# Altium project KitKTS.PrjPcb (part 1 of 3)
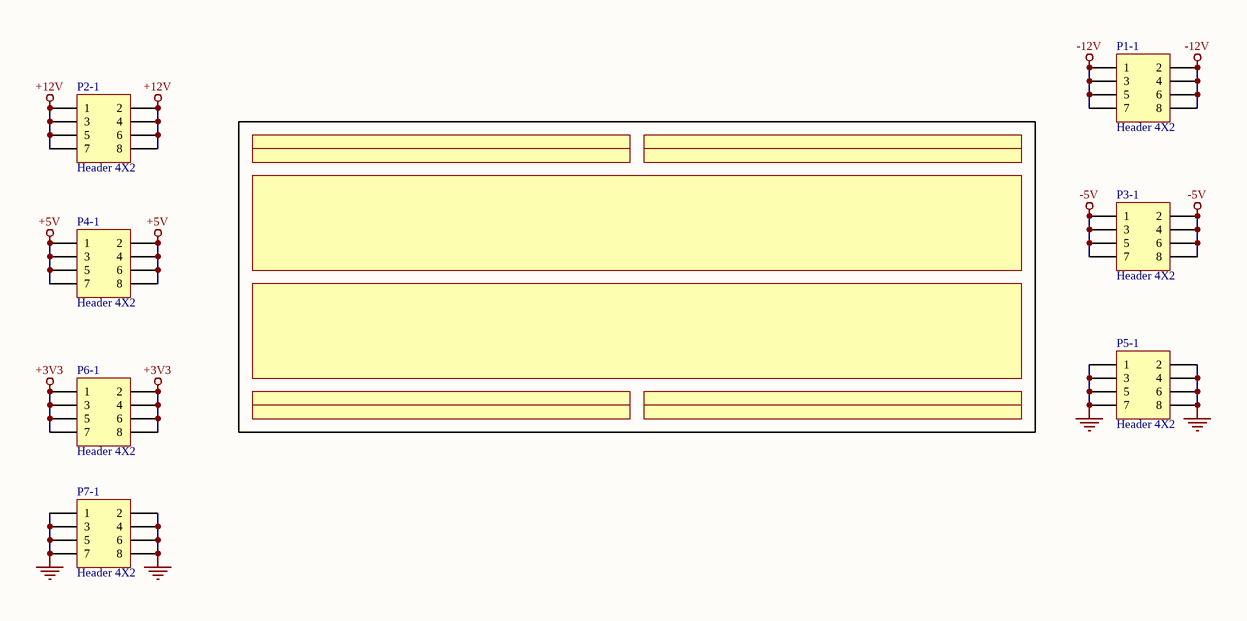
[diagram p0: 01-Breadboard.SchDoc]
26 sheets, 437 parts. Net scope: global (net labels, ports and power ports of the same name join across sheets).
Board file: KitKTS.PcbDoc
Sheets:
  01-Breadboard.SchDoc
  02-PowerSupply.SchDoc
  03-PulseGenerator.SchDoc
  04-LogicAND.SchDoc
  04-ANDStatusLed.SchDoc
  05-LogicOR.SchDoc
  05-ORStatusLed.SchDoc
  06-LogicNOT.SchDoc
  06-NOTStatusLed.SchDoc
  07-LogicXOR.SchDoc
  07-XORStatusLed.SchDoc
  08-LogicNAND.SchDoc
  08-NANDStatusLed.SchDoc
  09-LogicNOR.SchDoc
  09-NORStatusLed.SchDoc
  10-Buffer.SchDoc
  11-DFlipFlop.SchDoc
  12-JKFlipFlop.SchDoc
  13-Counter74LS90.SchDoc
  14-Counter74LS192.SchDoc
  15-DistanceSRF05.SchDoc
  16-BitSW.SchDoc
  16-BitSWStatusLed.SchDoc
  17-Led.SchDoc
  19-CPLD.SchDoc
  18-Led7.SchDoc

## Sheet 01-Breadboard.SchDoc
size A4; DocumentNumber: 4; SheetNumber: 1; SheetTotal: 26

### Parts
P1-1  Header 4X2  [JP2.54-F-2x04A]
P2-1  Header 4X2  [JP2.54-F-2x04A]
P3-1  Header 4X2  [JP2.54-F-2x04A]
P4-1  Header 4X2  [JP2.54-F-2x04A]
P5-1  Header 4X2  [JP2.54-F-2x04A]
P6-1  Header 4X2  [JP2.54-F-2x04A]
P7-1  Header 4X2  [JP2.54-F-2x04A]

### Nets
+3V3: P6-1.1 P6-1.2 P6-1.3 P6-1.4 P6-1.5 P6-1.6 P6-1.7 P6-1.8
+5V: P4-1.1 P4-1.2 P4-1.3 P4-1.4 P4-1.5 P4-1.6 P4-1.7 P4-1.8
+12V: P2-1.1 P2-1.2 P2-1.3 P2-1.4 P2-1.5 P2-1.6 P2-1.7 P2-1.8
-5V: P3-1.1 P3-1.2 P3-1.3 P3-1.4 P3-1.5 P3-1.6 P3-1.7 P3-1.8
-12V: P1-1.1 P1-1.2 P1-1.3 P1-1.4 P1-1.5 P1-1.6 P1-1.7 P1-1.8
GND: P5-1.1 P5-1.2 P5-1.3 P5-1.4 P5-1.5 P5-1.6 P5-1.7 P5-1.8 P7-1.1 P7-1.2 P7-1.3 P7-1.4 P7-1.5 P7-1.6 P7-1.7 P7-1.8

### Library data of the parts
P1-1 P2-1 P3-1 P4-1 P5-1 P6-1 P7-1 = Header 4X2: Header, 4-Pin, Dual row; LatestRevisionDate: 17-Jul-2002; LatestRevisionNote: Re-released for DXP Platform.; Publisher: Altium Limited

## Sheet 02-PowerSupply.SchDoc
size A4; DocumentNumber: 2; SheetNumber: 2; SheetTotal: 26
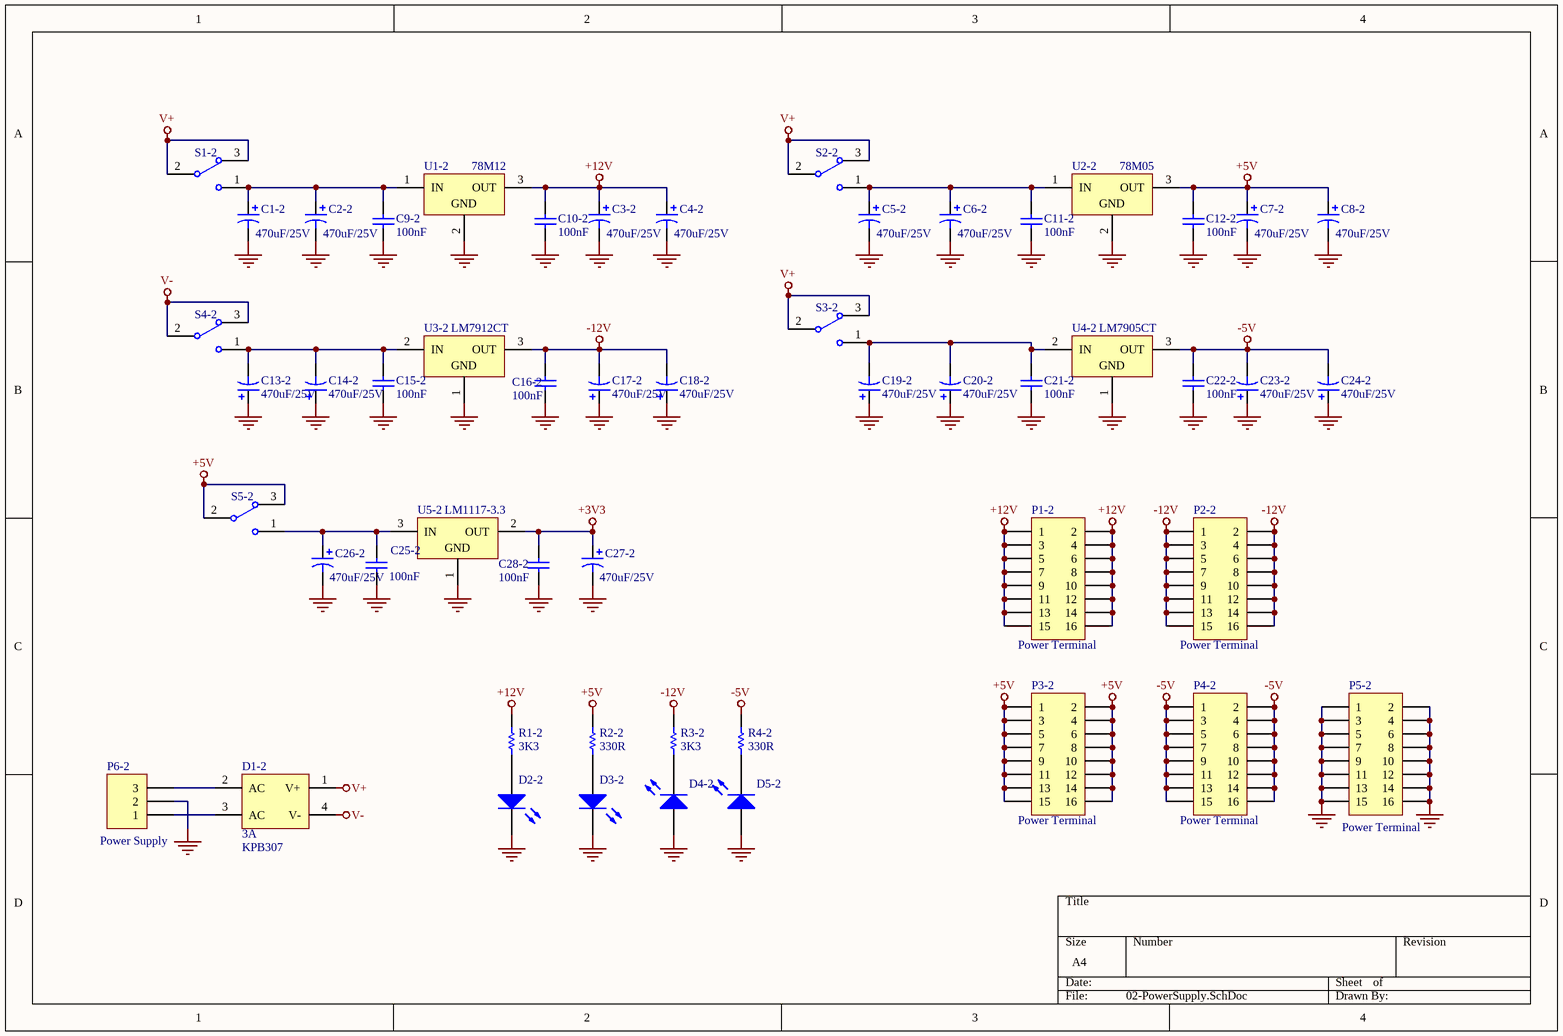
[diagram p1: 02-PowerSupply.SchDoc]

### Parts
C1-2  470uF/25V  [C-ALU-10x10mm]
C2-2  470uF/25V  [C-ALU-10x10mm]
C3-2  470uF/25V  [C-ALU-10x10mm]
C4-2  470uF/25V  [C-ALU-10x10mm]
C5-2  470uF/25V  [C-ALU-10x10mm]
C6-2  470uF/25V  [C-ALU-10x10mm]
C7-2  470uF/25V  [C-ALU-10x10mm]
C8-2  470uF/25V  [C-ALU-10x10mm]
C9-2  value 100nF  [c-0805]  (hidden comment: 104)
C10-2  value 100nF  [c-0805]  (hidden comment: 104)
C11-2  value 100nF  [c-0805]  (hidden comment: 104)
C12-2  value 100nF  [c-0805]  (hidden comment: 104)
C13-2  470uF/25V  [C-ALU-10x10mm]
C14-2  470uF/25V  [C-ALU-10x10mm]
C15-2  value 100nF  [c-0805]  (hidden comment: 104)
C16-2  value 100nF  [c-0805]  (hidden comment: 104)
C17-2  470uF/25V  [C-ALU-10x10mm]
C18-2  470uF/25V  [C-ALU-10x10mm]
C19-2  470uF/25V  [C-ALU-10x10mm]
C20-2  470uF/25V  [C-ALU-10x10mm]
C21-2  value 100nF  [c-0805]  (hidden comment: 104)
C22-2  value 100nF  [c-0805]  (hidden comment: 104)
C23-2  470uF/25V  [C-ALU-10x10mm]
C24-2  470uF/25V  [C-ALU-10x10mm]
C25-2  value 100nF  [c-0805]  (hidden comment: 104)
C26-2  470uF/25V  [C-ALU-10x10mm]
C27-2  470uF/25V  [C-ALU-10x10mm]
C28-2  value 100nF  [c-0805]  (hidden comment: 104)
D1-2  KPB307  value 3A  [D-DB-3A]
D2-2  LED  [LED-0805]  (value not drawn)
D3-2  LED  [LED-0805]  (value not drawn)
D4-2  LED  [LED-0805]  (value not drawn)
D5-2  LED  [LED-0805]  (value not drawn)
P1-2  value Power Terminal  [JP2.54-F-2x08A]  (hidden comment: Header 8X2)
P2-2  value Power Terminal  [JP2.54-F-2x08A]  (hidden comment: Header 8X2)
P3-2  value Power Terminal  [JP2.54-F-2x08A]  (hidden comment: Header 8X2)
P4-2  value Power Terminal  [JP2.54-F-2x08A]  (hidden comment: Header 8X2)
P5-2  value Power Terminal  [JP2.54-F-2x08A]  (hidden comment: Header 8X2)
P6-2  value Power Supply  [TER-KF128-3]  (hidden comment: H3)
R1-2  value 3K3  [R-0805]  (hidden comment: 332)
R2-2  value 330R  [R-0805]  (hidden comment: 331)
R3-2  value 3K3  [R-0805]  (hidden comment: 332)
R4-2  value 330R  [R-0805]  (hidden comment: 331)
S1-2  SW-SPDT  [SW-SLIDE-2P-2W]  (value not drawn)
S2-2  SW-SPDT  [SW-SLIDE-2P-2W]  (value not drawn)
S3-2  SW-SPDT  [SW-SLIDE-2P-2W]  (value not drawn)
S4-2  SW-SPDT  [SW-SLIDE-2P-2W]  (value not drawn)
S5-2  SW-SPDT  [SW-SLIDE-2P-2W]  (value not drawn)
U1-2  78M12  [TO-252-3]
U2-2  78M05  [TO-252-3]
U3-2  LM7912CT  [TO-263-3]
U4-2  LM7905CT  [TO-263-3]
U5-2  LM1117-3.3  [SOT-223-3]

### Nets
+3V3: C27-2.1 C28-2.2 U5-2.2(OUT)
+5V: C7-2.1 C8-2.1 C12-2.2 P3-2.1 P3-2.2 P3-2.3 P3-2.4 P3-2.5 P3-2.6 P3-2.7 P3-2.8 P3-2.9 P3-2.10 P3-2.11 P3-2.12 P3-2.13 P3-2.14 P3-2.15 P3-2.16 R2-2.1 S5-2.2 S5-2.3 U2-2.3(OUT)
+12V: C3-2.1 C4-2.1 C10-2.2 P1-2.1 P1-2.2 P1-2.3 P1-2.4 P1-2.5 P1-2.6 P1-2.7 P1-2.8 P1-2.9 P1-2.10 P1-2.11 P1-2.12 P1-2.13 P1-2.14 P1-2.15 P1-2.16 R1-2.1 U1-2.3(OUT)
-5V: C22-2.2 C23-2.2 C24-2.2 P4-2.1 P4-2.2 P4-2.3 P4-2.4 P4-2.5 P4-2.6 P4-2.7 P4-2.8 P4-2.9 P4-2.10 P4-2.11 P4-2.12 P4-2.13 P4-2.14 P4-2.15 P4-2.16 R4-2.1 U4-2.3(OUT)
-12V: C16-2.2 C17-2.2 C18-2.2 P2-2.1 P2-2.2 P2-2.3 P2-2.4 P2-2.5 P2-2.6 P2-2.7 P2-2.8 P2-2.9 P2-2.10 P2-2.11 P2-2.12 P2-2.13 P2-2.14 P2-2.15 P2-2.16 R3-2.1 U3-2.3(OUT)
GND: C1-2.2 C2-2.2 C3-2.2 C4-2.2 C5-2.2 C6-2.2 C7-2.2 C8-2.2 C9-2.1 C10-2.1 C11-2.1 C12-2.1 C13-2.1 C14-2.1 C15-2.1 C16-2.1 C17-2.1 C18-2.1 C19-2.1 C20-2.1 C21-2.1 C22-2.1 C23-2.1 C24-2.1 C25-2.1 C26-2.2 C27-2.2 C28-2.1 D2-2.1(K) D3-2.1(K) D4-2.2(A) D5-2.2(A) P5-2.1 P5-2.2 P5-2.3 P5-2.4 P5-2.5 P5-2.6 P5-2.7 P5-2.8 P5-2.9 P5-2.10 P5-2.11 P5-2.12 P5-2.13 P5-2.14 P5-2.15 P5-2.16 P6-2.2 U1-2.2(GND) U2-2.2(GND) U3-2.1(GND) U4-2.1(GND) U5-2.1(GND)
V+: D1-2.1(V+) S1-2.2 S1-2.3 S2-2.2 S2-2.3 S3-2.2 S3-2.3
V-: D1-2.4(V-) S4-2.2 S4-2.3
NetC1-2_1: C1-2.1 C2-2.1 C9-2.2 S1-2.1 U1-2.1(IN)
NetC5-2_1: C5-2.1 C6-2.1 C11-2.2 S2-2.1 U2-2.1(IN)
NetC13-2_2: C13-2.2 C14-2.2 C15-2.2 S4-2.1 U3-2.2(IN)
NetC19-2_2: C19-2.2 C20-2.2 C21-2.2 S3-2.1 U4-2.2(IN)
NetC25-2_2: C25-2.2 C26-2.1 S5-2.1 U5-2.3(IN)
NetD1-2_2: D1-2.2(AC) P6-2.3
NetD1-2_3: D1-2.3(AC) P6-2.1
NetD2-2_2: D2-2.2(A) R1-2.2
NetD3-2_2: D3-2.2(A) R2-2.2
NetD4-2_1: D4-2.1(K) R3-2.2
NetD5-2_1: D5-2.1(K) R4-2.2

### Library data of the parts
C1-2 C2-2 C3-2 C4-2 C5-2 C6-2 C7-2 C8-2 C13-2 C14-2 C17-2 C18-2 C19-2 C20-2 C23-2 C24-2 C26-2 C27-2 = Cap Pol1: Polarized Capacitor (Radial)
C9-2 C10-2 C11-2 C12-2 C15-2 C16-2 C21-2 C22-2 C25-2 C28-2 = Cap: Capacitor; Manufacturer: Generic Components; Class: Passive; Published: 08/06/2000; Publisher: Altium Hobart Technology Centre; SubClass: Capacitor
D1-2 = Bridge2: Diode Bridge; Published: 24-Mar-1999; LatestRevisionDate: 17-Jul-2002; LatestRevisionNote: Re-released for DXP Platform.; PackageReference: D-46_6A
D2-2 D3-2 D4-2 D5-2 = LED0: Typical INFRARED GaAs LED; Published: 8-Jun-2000; LatestRevisionDate: 08-Jul-2005; LatestRevisionNote: Mech Layer 1 removed.; PackageReference: LED-0; Publisher: Altium Limited; Value: LED
P1-2 P2-2 P3-2 P4-2 P5-2 = Header 8X2: Header, 8-Pin, Dual row; LatestRevisionDate: 17-Jul-2002; LatestRevisionNote: Re-released for DXP Platform.
P6-2 = Header 3: Header, 3-Pin; LatestRevisionDate: 17-Jul-2002; LatestRevisionNote: Re-released for DXP Platform.
R1-2 R2-2 R3-2 R4-2 = Res1: Resistor; Published: 8-Jun-2000; LatestRevisionDate: 17-Jul-2002; LatestRevisionNote: Re-released for DXP Platform.; PackageReference: AXIAL-0.3; Publisher: Altium Limited
S1-2 S2-2 S3-2 S4-2 S5-2 = SW-SPDT: SPDT Subminiature Toggle Switch, Right Angle Mounting, Vertical Actuation; Link: http://banlinhkien.vn/goods-5937-cong-tac-gat-6-chan-mss22d18-smd.html
U1-2 U2-2 = LM78M05CT: 3-Terminal Positive Voltage Regulators, 3-pin TO-220; Manufacturer: National Semiconductor; PackageTopMarking: NSUZXYTTE#*LM341T-5.0*LM78M05CT; PowerWise: N; CompType: LDO IC; Published: 4-Dec-2008; DatasheetVersion: Aug-2005; PackageVersion: revL, Jan-1992; PackageReference: T03B; Publisher: Altium Limited; PackageDescription: TO-220, Molded, 3 Lead, Straight; Supplier 1: Farnell; PartNumber: LM78M05CT; RoHS: N; PinCount: 3; ComponentLink1Description: LM78M05 Datasheet; ComponentLink1URL: http://www.national.com/ds/LM/LM78M05.pdf; ComponentLink2Description: LM78M05 Web Page; ComponentLink2URL: http://www.national.com/pf/LM/LM78M05.html; ComponentLink3Description: T03B Package Page; ComponentLink3URL: http://www.national.com/packaging/folders/t03b.html
  U1-2: Value: 78M12
  U2-2: Value: 78M05
U3-2 U4-2 = LM79M12CT: 3-Terminal Negative Regulators, 3-pin TO-220; Manufacturer: National Semiconductor; PackageTopMarking: NSUZXYTTE#*LM79M*12CT; PowerWise: N; CompType: LDO IC; Published: 4-Dec-2008; DatasheetVersion: Sep-2001; PackageVersion: revL, Jan-1992; PackageReference: T03B; Publisher: Altium Limited; PackageDescription: TO-220, Molded, 3 Lead, Straight; Supplier 1: Farnell; PartNumber: LM79M12CT; RoHS: N; PinCount: 3; ComponentLink1Description: LM79M12 Datasheet; ComponentLink1URL: http://www.national.com/ds/LM/LM79M12.pdf; ComponentLink2Description: LM79M12 Web Page; ComponentLink2URL: http://www.national.com/pf/LM/LM79M12.html; ComponentLink3Description: T03B Package Page; ComponentLink3URL: http://www.national.com/packaging/folders/t03b.html
  U3-2: Value: LM7912CT
  U4-2: Value: LM7905CT
U5-2 = LM1117IDTX-3.3: 800mA Low-Dropout Linear Regulator, 3-pin TO-252; Manufacturer: National Semiconductor; PackageTopMarking: NSUZXYTT*LM1117*IDT-3.3; PowerWise: N; CompType: LDO IC; Published: 1-Mar-2010; DatasheetVersion: Apr-2006; PackageVersion: revD, Feb-2009; PackageReference: TD03B; Publisher: Altium Limited; PackageDescription: TO252, Molded, Jedec, 6.8 x 6.10 x 2.30mm Body, 3 Lead, 2.28mm Pitch, Surface Mount; PartNumber: LM1117IDTX-3.3; Value: LM1117-3.3; PinCount: 3; Code_JEDEC: TO-252-AA; ComponentLink1Description: LM1117 Datasheet; ComponentLink1URL: http://www.national.com/ds/LM/LM1117.pdf; ComponentLink2Description: LM1117 Web Page; ComponentLink2URL: http://www.national.com/pf/LM/LM1117.html; ComponentLink3Description: TD03B Package Page; ComponentLink3URL: http://www.national.com/packaging/folders/td03b.html

## Sheet 03-PulseGenerator.SchDoc
size A4; DocumentNumber: 3; SheetNumber: 3; SheetTotal: 26
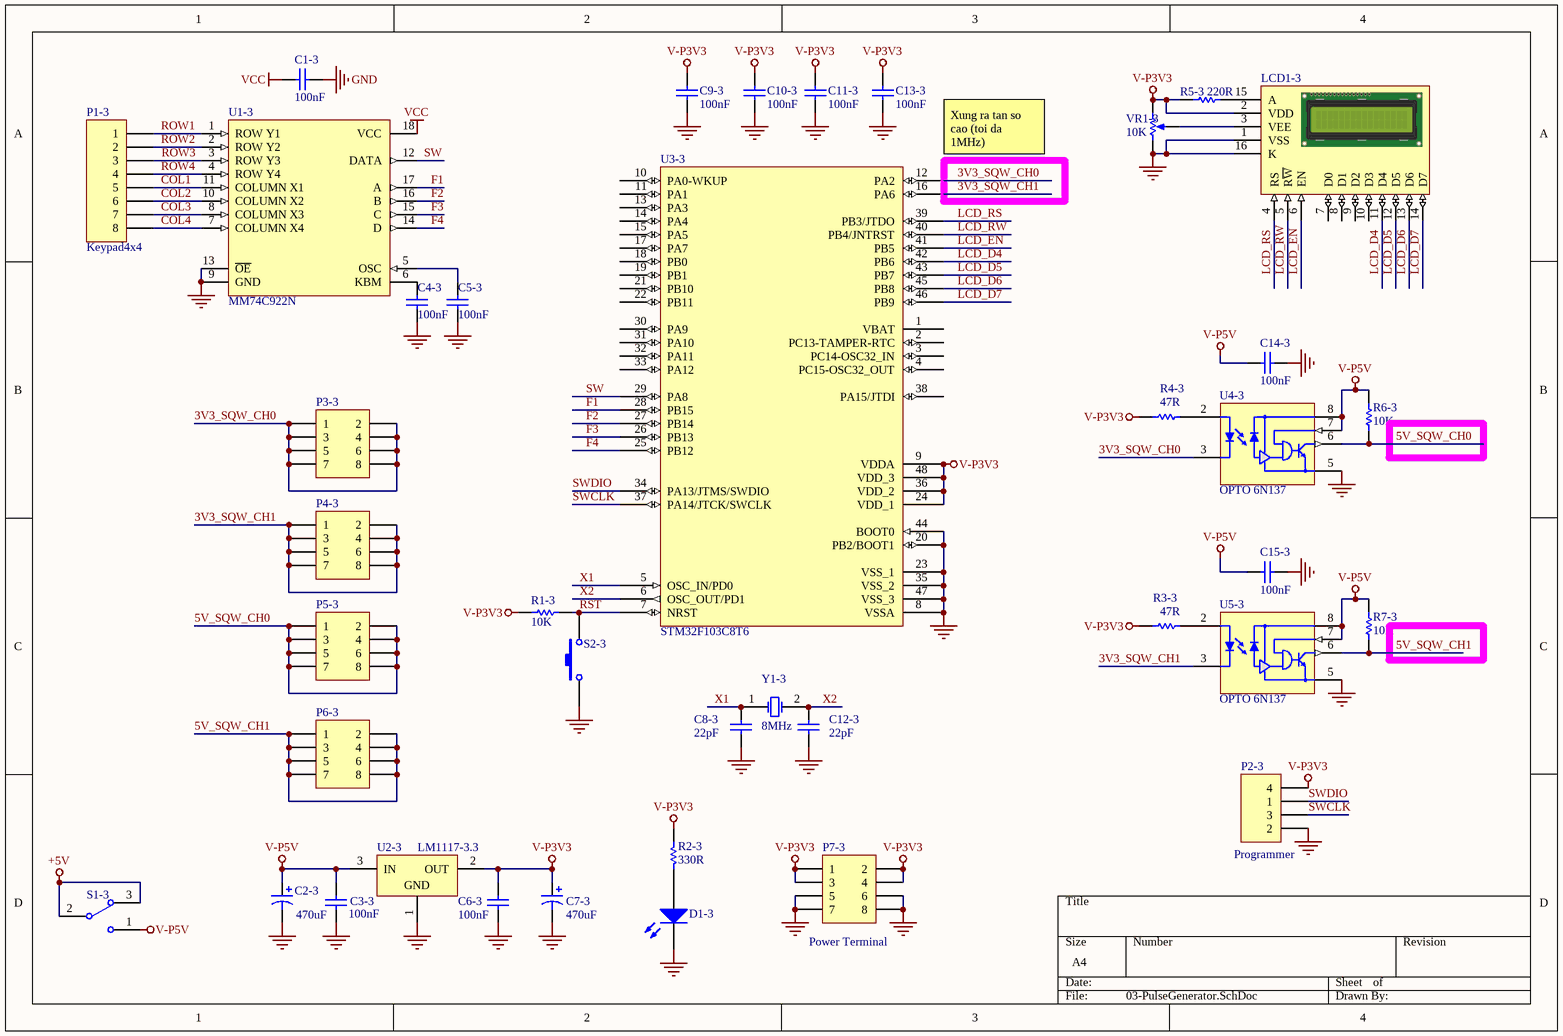
[diagram p2: 03-PulseGenerator.SchDoc]

### Parts
C1-3  value 100nF  [c-0805]  (hidden comment: 104)
C2-3  value 470uF  [C-ALU-10x10mm]  (hidden comment: 470uF/16V)
C3-3  value 100nF  [c-0805]  (hidden comment: 104)
C4-3  value 100nF  [c-0805]  (hidden comment: 104)
C5-3  value 100nF  [c-0805]  (hidden comment: 104)
C6-3  value 100nF  [c-0805]  (hidden comment: 104)
C7-3  value 470uF  [C-ALU-10x10mm]  (hidden comment: 470uF/16V)
C8-3  value 22pF  [c-0805]  (hidden comment: 22)
C9-3  value 100nF  [c-0805]  (hidden comment: 104)
C10-3  value 100nF  [c-0805]  (hidden comment: 104)
C11-3  value 100nF  [c-0805]  (hidden comment: 104)
C12-3  value 22pF  [c-0805]  (hidden comment: 22)
C13-3  value 100nF  [c-0805]  (hidden comment: 104)
C14-3  value 100nF  [c-0805]  (hidden comment: 104)
C15-3  value 100nF  [c-0805]  (hidden comment: 104)
D1-3  LED  [LED-0805]  (value not drawn)
LCD1-3  LCD1602  [LCD-1602A]  (value not drawn)
P1-3  Keypad4x4  [KEYPAD-4x4A]
P2-3  value Programmer  [JP2.54-M-1x04A]  (hidden comment: H4)
P3-3  Header 4X2  [JP2.54-F-2x04A]  (value not drawn)
P4-3  Header 4X2  [JP2.54-F-2x04A]  (value not drawn)
P5-3  Header 4X2  [JP2.54-F-2x04A]  (value not drawn)
P6-3  Header 4X2  [JP2.54-F-2x04A]  (value not drawn)
P7-3  Publisher: Power Terminal  [JP2.54-F-2x04A]  (hidden comment: Header 4X2)
R1-3  value 10K  [R-0805]  (hidden comment: Res1)
R2-3  value 330R  [R-0805]  (hidden comment: 331)
R3-3  47R  [R-0805]
R4-3  47R  [R-0805]
R5-3  220R  [R-0805]
R6-3  value 10K  [R-0805]  (hidden comment: Res1)
R7-3  value 10K  [R-0805]  (hidden comment: Res1)
S1-3  SW-SPDT  [SW-SLIDE-2P-2W]  (value not drawn)
S2-3  SW-S6  [SW-T-S6-SMD]  (value not drawn)
U1-3  MM74C922N  [SK-DIP18-300]
U2-3  LM1117-3.3  [SOT-223-3]
U3-3  STM32F103C8T6  [LQFP-48]
U4-3  OPTO 6N137  [DIP8-300-SMD]
U5-3  OPTO 6N137  [DIP8-300-SMD]
VR1-3  10K  [VR-3362P]
Y1-3  8MHz  [XTAL-CSM7]

### Nets
+5V: S1-3.2 S1-3.3
GND: C1-3.2 C2-3.2 C3-3.1 C4-3.2 C5-3.2 C6-3.1 C7-3.2 C8-3.1 C9-3.1 C10-3.1 C11-3.1 C12-3.1 C13-3.1 C14-3.1 C15-3.1 D1-3.2(K) LCD1-3.1(VSS) LCD1-3.16(K) P2-3.2 P7-3.5 P7-3.6 P7-3.7 P7-3.8 S2-3.1 U1-3.9(GND) U1-3.13(~{OE}) U2-3.1(GND) U3-3.8(VSSA) U3-3.20(PB2/BOOT1) U3-3.23(VSS_1) U3-3.35(VSS_2) U3-3.44(BOOT0) U3-3.47(VSS_3) U4-3.5(GND) U5-3.5(GND) VR1-3.1(TOP)
V-P3V3: C6-3.2 C7-3.1 C9-3.2 C10-3.2 C11-3.2 C13-3.2 LCD1-3.2(VDD) P2-3.4 P7-3.1 P7-3.2 P7-3.3 P7-3.4 R1-3.2 R2-3.1 R3-3.1 R4-3.1 R5-3.1 U2-3.2(OUT) U3-3.9(VDDA) U3-3.24(VDD_1) U3-3.36(VDD_2) U3-3.48(VDD_3) VR1-3.3(BOT)
V-P5V: C2-3.1 C3-3.2 C14-3.2 C15-3.2 R6-3.1 R7-3.1 S1-3.1 U2-3.3(IN) U4-3.7(EN) U4-3.8(VCC) U5-3.7(EN) U5-3.8(VCC)
VCC: C1-3.1 U1-3.18(VCC)
3V3_SQW_CH0: P3-3.1 P3-3.2 P3-3.3 P3-3.4 P3-3.5 P3-3.6 P3-3.7 P3-3.8 U3-3.12(PA2) U4-3.3(VF-)
3V3_SQW_CH1: P4-3.1 P4-3.2 P4-3.3 P4-3.4 P4-3.5 P4-3.6 P4-3.7 P4-3.8 U3-3.16(PA6) U5-3.3(VF-)
5V_SQW_CH0: P5-3.1 P5-3.2 P5-3.3 P5-3.4 P5-3.5 P5-3.6 P5-3.7 P5-3.8 R6-3.2 U4-3.6(Vo)
5V_SQW_CH1: P6-3.1 P6-3.2 P6-3.3 P6-3.4 P6-3.5 P6-3.6 P6-3.7 P6-3.8 R7-3.2 U5-3.6(Vo)
COL1: P1-3.5 U1-3.11(COLUMN_X1)
COL2: P1-3.6 U1-3.10(COLUMN_X2)
COL3: P1-3.7 U1-3.8(COLUMN_X3)
COL4: P1-3.8 U1-3.7(COLUMN_X4)
F1: U1-3.17(A) U3-3.28(PB15)
F2: U1-3.16(B) U3-3.27(PB14)
F3: U1-3.15(C) U3-3.26(PB13)
F4: U1-3.14(D) U3-3.25(PB12)
LCD_D4: LCD1-3.11(D4) U3-3.42(PB6)
LCD_D5: LCD1-3.12(D5) U3-3.43(PB7)
LCD_D6: LCD1-3.13(D6) U3-3.45(PB8)
LCD_D7: LCD1-3.14(D7) U3-3.46(PB9)
LCD_EN: LCD1-3.6(EN) U3-3.41(PB5)
LCD_RS: LCD1-3.4(RS) U3-3.39(PB3/JTDO)
LCD_RW: LCD1-3.5(R~{W}) U3-3.40(PB4/JNTRST)
ROW1: P1-3.1 U1-3.1(ROW_Y1)
ROW2: P1-3.2 U1-3.2(ROW_Y2)
ROW3: P1-3.3 U1-3.3(ROW_Y3)
ROW4: P1-3.4 U1-3.4(ROW_Y4)
RST: R1-3.1 S2-3.2 U3-3.7(NRST)
SW: U1-3.12(DATA) U3-3.29(PA8)
SWCLK: P2-3.3 U3-3.37(PA14/JTCK/SWCLK)
SWDIO: P2-3.1 U3-3.34(PA13/JTMS/SWDIO)
X1: C8-3.2 U3-3.5(OSC_IN/PD0) Y1-3.1(OSC1)
X2: C12-3.2 U3-3.6(OSC_OUT/PD1) Y1-3.2(OSC2)
NetC4-3_1: C4-3.1 U1-3.6(KBM)
NetC5-3_1: C5-3.1 U1-3.5(OSC)
NetD1-3_1: D1-3.1(A) R2-3.2
NetLCD1-3_3: LCD1-3.3(VEE) VR1-3.2(TAP)
NetLCD1-3_15: LCD1-3.15(A) R5-3.2
NetR3-3_2: R3-3.2 U5-3.2(VF+)
NetR4-3_2: R4-3.2 U4-3.2(VF+)

Not connected (* = marked no-connect by the designer): LCD1-3 7(D0) 8(D1) 9(D2) 10(D3); U3-3 1(VBAT) 2(PC13-TAMPER-RTC) 3(PC14-OSC32_IN) 4(PC15-OSC32_OUT) 10(PA0-WKUP) 11(PA1) 13(PA3) 14(PA4) 15(PA5) 17(PA7) 18(PB0) 19(PB1) 21(PB10) 22(PB11) 30(PA9) 31(PA10) 32(PA11) 33(PA12) 38(PA15/JTDI); U4-3 1(NC) 4(NC); U5-3 1(NC) 4(NC)

### Notes on the sheet
- Xung ra tan so cao (toi da 1MHz)

### Library data of the parts
C1-3 C4-3 C5-3 = Cap: CAP CER 0.1UF 50V Y5V 0805; Manufacturer: Yageo; Manufacturer Part Number: CC0805ZRY5V9BB104; Capacitance: 0.10µF; Tolerance: -20%, +80%; Temperature Coefficient: Y5V (F); Supplier 1: Digi-Key; Supplier Part Number 1: 311-1361-1-ND; RoHS: RoHS Compliant; Category: Capacitors; Stock 1: 348816; Pricing 1: 1=0.1, 10=0.033, 25=0.0232, 100=0.0151, 250=0.01232, 500=0.01056, 1000=0.00822 (USD); Packaging: Cut Tape (CT); Part Status: Active; Voltage - Rated: 50V; Mounting Type: Surface Mount, MLCC; Operating Temperature: -30°C ~ 85°C; Applications: General Purpose; Ratings: -; Package / Case: 0805 (2012 Metric); Size / Dimension: 0.079" L x 0.049" W (2.00mm x 1.25mm); Height - Seated (Max): -; Thickness (Max): 0.024" (0.60mm); Lead Spacing: -; Features: -; Lead Style: -; ComponentLink1URL: http://www.yageo.com/documents/recent/UPY-GPHC_Y5V_6.3V-to-50V_6.pdf; ComponentLink1Description: http://www.yageo.com/documents/recent/UPY-GPHC_Y5V_6.3V-to-50V_6.pdf
C2-3 C7-3 = Cap Pol1: Polarized Capacitor (Radial); Published: 8-Jun-2000; LatestRevisionDate: 17-Jul-2002; LatestRevisionNote: Re-released for DXP Platform.; PackageReference: RB7.6-15; Publisher: Altium Limited
C3-3 C6-3 C8-3 C12-3 = Cap: as C9-2 on sheet 02-PowerSupply; Published: 08/06/2000; Publisher: Altium Hobart Technology Centre; SubClass: Capacitor
C9-3 C10-3 C11-3 C13-3 C14-3 C15-3 = Cap: Capacitor; Published: 8-Jun-2000; LatestRevisionDate: 17-Jul-2002; LatestRevisionNote: Re-released for DXP Platform.; PackageReference: RAD-0.3; Publisher: Altium Limited; PackageDescription: Radial Cap, Thru-Hole; 2 Leads; 0.3 in Pin Spacing
D1-3 = LED0: Typical INFRARED GaAs LED; Published: 8-Jun-2000; LatestRevisionDate: 08-Jul-2005; LatestRevisionNote: Mech Layer 1 removed.; PackageReference: LED-0; Publisher: Altium Limited; Value: LED
LCD1-3 = LCD1602: Liquid Crystal Display; Value: LCD1602
P1-3 = Header 8: Header, 8-Pin; LatestRevisionDate: 17-Jul-2002; LatestRevisionNote: Re-released for DXP Platform.; Publisher: Altium Limited
P2-3 = Header 4: Header, 4-Pin; LatestRevisionDate: 17-Jul-2002; LatestRevisionNote: Re-released for DXP Platform.
P3-3 P4-3 P5-3 P6-3 P7-3 = Header 4X2: Header, 4-Pin, Dual row; LatestRevisionDate: 17-Jul-2002; LatestRevisionNote: Re-released for DXP Platform.
  P3-3 P4-3 P5-3 P6-3: Publisher: Power Terminal
R1-3 R2-3 R3-3 R4-3 R5-3 R6-3 R7-3 = Res1: Resistor; Published: 8-Jun-2000; LatestRevisionDate: 17-Jul-2002; LatestRevisionNote: Re-released for DXP Platform.; PackageReference: AXIAL-0.3; Publisher: Altium Limited
  R3-3 R4-3: Value: 47R
  R5-3: PackageDescription: Axial Device, Thru-Hole; 2 Leads; 0.3 in Pin Spacing; Value: 220R
S1-3 = SW-SPDT: as S1-2 on sheet 02-PowerSupply; Link: http://banlinhkien.vn/goods-5937-cong-tac-gat-6-chan-mss22d18-smd.html
S2-3 = SW-PB: Switch; Value: Reset; Published: 24-Mar-1999; LatestRevisionDate: 17-Jul-2002; LatestRevisionNote: Re-released for DXP Platform.; PackageReference: SPST-2; PackageDescription: Switch; 2 Leads
U2-3 = LM1117IDTX-3.3: as U5-2 on sheet 02-PowerSupply; Published: 1-Mar-2010; DatasheetVersion: Apr-2006; PackageVersion: revD, Feb-2009; PackageReference: TD03B; Publisher: Altium Limited; PackageDescription: TO252, Molded, Jedec, 6.8 x 6.10 x 2.30mm Body, 3 Lead, 2.28mm Pitch, Surface Mount; PartNumber: LM1117IDTX-3.3; Value: LM1117-3.3; PinCount: 3; Code_JEDEC: TO-252-AA; ComponentLink1Description: LM1117 Datasheet; ComponentLink1URL: http://www.national.com/ds/LM/LM1117.pdf; ComponentLink2Description: LM1117 Web Page; ComponentLink2URL: http://www.national.com/pf/LM/LM1117.html; ComponentLink3Description: TD03B Package Page; ComponentLink3URL: http://www.national.com/packaging/folders/td03b.html
U3-3 = STM32F103C8T6: STM32 ARM-based 32-bit MCU with 64 Kbytes Flash, 48-pin LQFP, Industrial Temperature; Published: 30-May-2008; DatasheetVersion: rev6, Mar-2008; PackageVersion: Mar-2008; PackageReference: LQFP48; Publisher: Altium Limited; PackageDescription: 48-Pin Low-Profile Quad Flat Pack, 7 x 7 mm Body, 0.5 mm Pitch (LQFP48); ComponentLink1Description: Manufacturer Link; ComponentLink1URL: www.st.com/stm32; ComponentLink2Description: Datasheet; ComponentLink2URL: http://www.st.com/stonline/products/literature/ds/13587.pdf
U4-3 U5-3 = OPTO 6N137: High Speed 10MBit/s Logic Gata Optocouplers; Value: 6N137
VR1-3 = RPot: Potentiometer; Sim Note: Enter the Resistance value and the set point into parameter fields.; Set Position: 0.5; Published: 8-Jun-2000; LatestRevisionDate: 17-Jul-2002; LatestRevisionNote: Re-released for DXP Platform.; PackageReference: VR5; Publisher: Altium Limited; PackageDescription: Variable Resistor, Thru-Hole; 3 Leads; Value: 10K
Y1-3 = XTAL: Crystal Oscillator; Published: 8-Jun-2000; LatestRevisionDate: 17-Jul-2002; LatestRevisionNote: Re-released for DXP Platform.; PackageReference: R38; Value: 8MHz; PackageDescription: Crystal, Thru-Hole; 2 Leads; Body 3.1 x 8.2 mm (Dia.xH)

## Sheet 04-LogicAND.SchDoc
size A4; DocumentNumber: 4; SheetNumber: 4; SheetTotal: 26
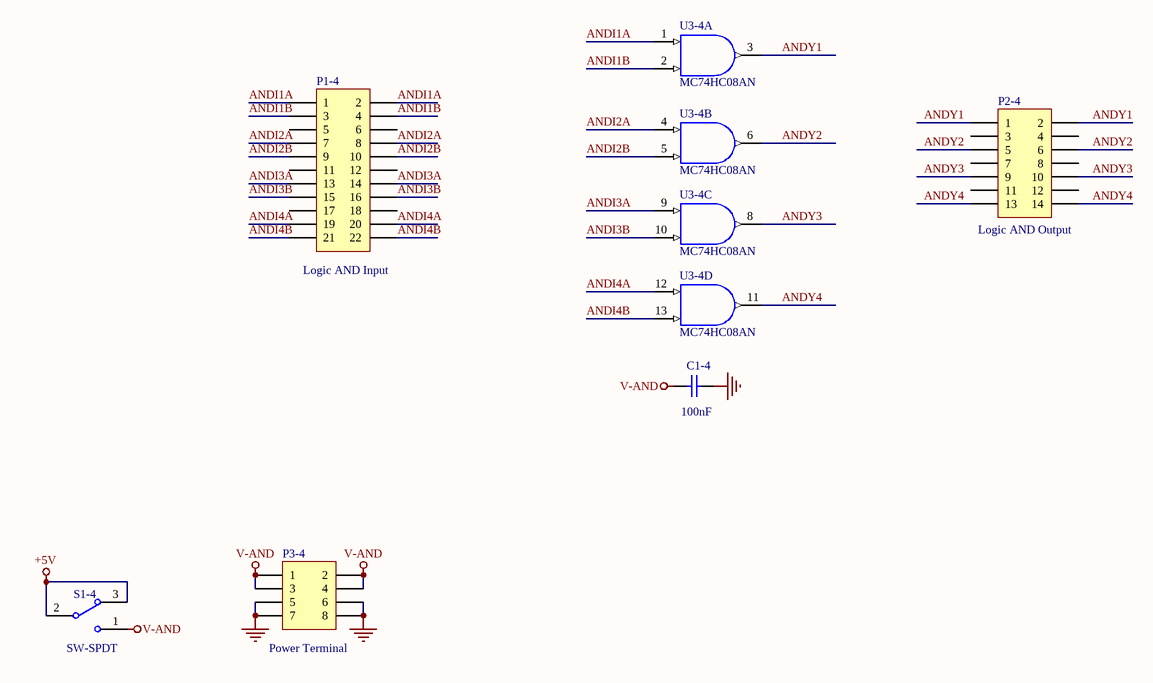
[diagram p3: 04-LogicAND.SchDoc]

### Parts
C1-4  value 100nF  [c-0805]  (hidden comment: 104)
P1-4  value Logic AND Input  [JP2.54-F-2x11A]  (hidden comment: Header 11X2)
P2-4  value Logic AND Output  [JP2.54-F-2x07A]  (hidden comment: H7X2)
P3-4  Publisher: Power Terminal  [JP2.54-F-2x04A]  (hidden comment: Header 4X2)
S1-4  SW-SPDT  [SW-SLIDE-2P-2W]
U3-4  MC74HC08AN  [SK-DIP14-300]  (parts A,B,C,D of 4)

### Nets
+5V: S1-4.2 S1-4.3
GND: C1-4.2 P3-4.5 P3-4.6 P3-4.7 P3-4.8 U3-4.7(GND)
V-AND: C1-4.1 P3-4.1 P3-4.2 P3-4.3 P3-4.4 S1-4.1
VDD: U3-4.14(V-AND)
ANDI1A: P1-4.1 P1-4.2 U3-4.1(A)
ANDI1B: P1-4.3 P1-4.4 U3-4.2(B)
ANDI2A: P1-4.7 P1-4.8 U3-4.4(A)
ANDI2B: P1-4.9 P1-4.10 U3-4.5(B)
ANDI3A: P1-4.13 P1-4.14 U3-4.9(A)
ANDI3B: P1-4.15 P1-4.16 U3-4.10(B)
ANDI4A: P1-4.19 P1-4.20 U3-4.12(A)
ANDI4B: P1-4.21 P1-4.22 U3-4.13(B)
ANDY1: P2-4.1 P2-4.2 U3-4.3(Y)
ANDY2: P2-4.5 P2-4.6 U3-4.6(Y)
ANDY3: P2-4.9 P2-4.10 U3-4.8(Y)
ANDY4: P2-4.13 P2-4.14 U3-4.11(Y)

Not connected (* = marked no-connect by the designer): P1-4 5 6 11 12 17 18; P2-4 3 4 7 8 11 12

### Library data of the parts
C1-4 = Cap: Capacitor; Published: 8-Jun-2000; LatestRevisionDate: 17-Jul-2002; LatestRevisionNote: Re-released for DXP Platform.; PackageReference: RAD-0.3; Publisher: Altium Limited; PackageDescription: Radial Cap, Thru-Hole; 2 Leads; 0.3 in Pin Spacing
P1-4 = Header 11X2: Header, 11-Pin, Dual row; LatestRevisionDate: 17-Jul-2002; LatestRevisionNote: Re-released for DXP Platform.
P2-4 = Header 7X2: Header, 7-Pin, Dual row; LatestRevisionDate: 17-Jul-2002; LatestRevisionNote: Re-released for DXP Platform.
P3-4 = Header 4X2: Header, 4-Pin, Dual row; LatestRevisionDate: 17-Jul-2002; LatestRevisionNote: Re-released for DXP Platform.
S1-4 = SW-SPDT: as S1-2 on sheet 02-PowerSupply; Published: 24-Mar-1999; LatestRevisionDate: 17-Dec-2003; LatestRevisionNote: Schematic revised, PCB Footprint replaced.; DatasheetVersion: 05-Dec-2000; PackageReference: TL36WW15050; Publisher: Altium Limited; PackageDescription: Switch; 4 Leads; ComponentLink1Description: Manufacturer Link; ComponentLink1URL: http://www.apem.com
U3-4 = MC74HC08AN: Quad 2-Input AND Gate; Published: 17-Jul-2002; LatestRevisionDate: 06-Jun-2005; LatestRevisionNote: Stylized 3D Model Added; DatasheetVersion: 1989; PackageVersion: 1997; PackageReference: 646-06; Publisher: Altium Limited; PackageDescription: DIP; 14 Leads; Row Spacing 7.62 mm; Pitch 2.54 mm; ComponentLink1Description: Manufacturer Link; ComponentLink1URL: http://www.onsemi.com/site/products/parametrics/0,4446,247,00.html; ComponentLink2Description: Ibis Model; ComponentLink2URL: http://www.onsemi.com/pub/Collateral/MC54HC08AJ.IBS

## Sheet 04-ANDStatusLed.SchDoc
size A4; DocumentNumber: 4; SheetNumber: 4; SheetTotal: 26
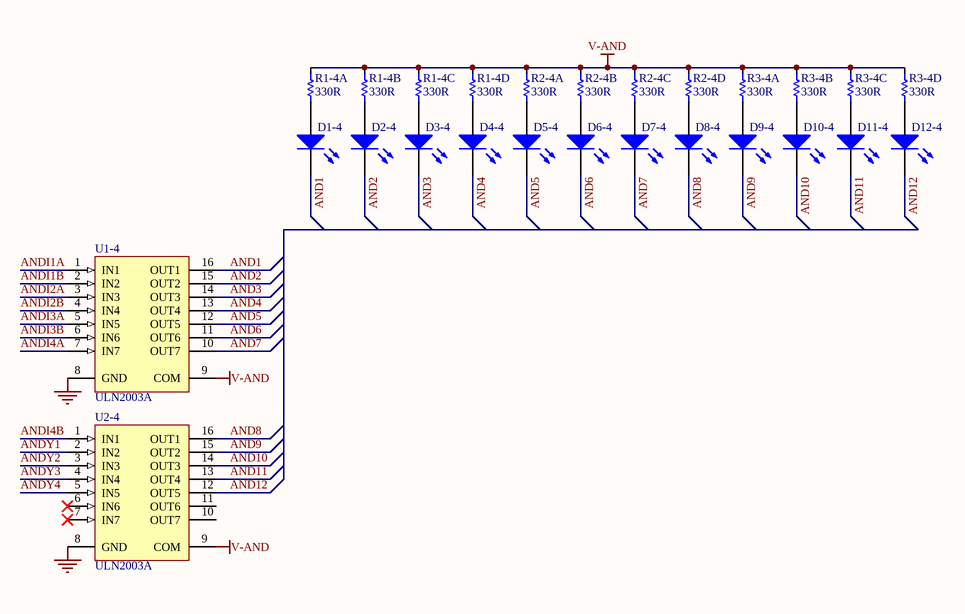
[diagram p4: 04-ANDStatusLed.SchDoc]

### Parts
D1-4  LED  [LED-0805]  (value not drawn)
D2-4  LED  [LED-0805]  (value not drawn)
D3-4  LED  [LED-0805]  (value not drawn)
D4-4  LED  [LED-0805]  (value not drawn)
D5-4  LED  [LED-0805]  (value not drawn)
D6-4  LED  [LED-0805]  (value not drawn)
D7-4  LED  [LED-0805]  (value not drawn)
D8-4  LED  [LED-0805]  (value not drawn)
D9-4  LED  [LED-0805]  (value not drawn)
D10-4  LED  [LED-0805]  (value not drawn)
D11-4  LED  [LED-0805]  (value not drawn)
D12-4  LED  [LED-0805]  (value not drawn)
R1-4  330R  [R-Array-0603-4]  (parts A,B,C,D of 4)
R2-4  330R  [R-Array-0603-4]  (parts A,B,C,D of 4)
R3-4  330R  [R-Array-0603-4]  (parts A,B,C,D of 4)
U1-4  ULN2003A  [SOIC-16]
U2-4  ULN2003A  [SOIC-16]

### Nets
GND: U1-4.8(GND) U2-4.8(GND)
V-AND: R1-4.2 R1-4.4 R1-4.6 R1-4.8 R2-4.2 R2-4.4 R2-4.6 R2-4.8 R3-4.2 R3-4.4 R3-4.6 R3-4.8 U1-4.9(COM) U2-4.9(COM)
AND1: D1-4.2(K) U1-4.16(OUT1)
AND2: D2-4.2(K) U1-4.15(OUT2)
AND3: D3-4.2(K) U1-4.14(OUT3)
AND4: D4-4.2(K) U1-4.13(OUT4)
AND5: D5-4.2(K) U1-4.12(OUT5)
AND6: D6-4.2(K) U1-4.11(OUT6)
AND7: D7-4.2(K) U1-4.10(OUT7)
AND8: D8-4.2(K) U2-4.16(OUT1)
AND9: D9-4.2(K) U2-4.15(OUT2)
AND10: D10-4.2(K) U2-4.14(OUT3)
AND11: D11-4.2(K) U2-4.13(OUT4)
AND12: D12-4.2(K) U2-4.12(OUT5)
ANDI1A: U1-4.1(IN1)
ANDI1B: U1-4.2(IN2)
ANDI2A: U1-4.3(IN3)
ANDI2B: U1-4.4(IN4)
ANDI3A: U1-4.5(IN5)
ANDI3B: U1-4.6(IN6)
ANDI4A: U1-4.7(IN7)
ANDI4B: U2-4.1(IN1)
ANDY1: U2-4.2(IN2)
ANDY2: U2-4.3(IN3)
ANDY3: U2-4.4(IN4)
ANDY4: U2-4.5(IN5)
NetD1-4_1: D1-4.1(A) R1-4.1
NetD2-4_1: D2-4.1(A) R1-4.3
NetD3-4_1: D3-4.1(A) R1-4.5
NetD4-4_1: D4-4.1(A) R1-4.7
NetD5-4_1: D5-4.1(A) R2-4.1
NetD6-4_1: D6-4.1(A) R2-4.3
NetD7-4_1: D7-4.1(A) R2-4.5
NetD8-4_1: D8-4.1(A) R2-4.7
NetD9-4_1: D9-4.1(A) R3-4.1
NetD10-4_1: D10-4.1(A) R3-4.3
NetD11-4_1: D11-4.1(A) R3-4.5
NetD12-4_1: D12-4.1(A) R3-4.7

Not connected (* = marked no-connect by the designer): U2-4 6(IN6)* 7(IN7)* 10(OUT7) 11(OUT6)

### Library data of the parts
D1-4 D2-4 D3-4 D4-4 D5-4 D6-4 D7-4 D8-4 D9-4 D10-4 D11-4 D12-4 = LED2: Typical RED, GREEN, YELLOW, AMBER GaAs LED; Published: 8-Jun-2000; LatestRevisionDate: 17-Jul-2002; LatestRevisionNote: Re-released for DXP Platform.; PackageVersion: Feb-2002; PackageReference: 3.2X1.6X1.1; Publisher: Altium Limited; PackageDescription: SM LED; 2 Flat Leads
R1-4 R2-4 R3-4 = Res Array 4: RES ARRAY 4 RES 330 OHM 1206; Manufacturer: Panasonic Electronic Components; Manufacturer Part Number: EXB-38V331JV; Digi-Key Part Number: Y9331TR-ND; Link: http://www.digikey.com/product-detail/en/EXB-38V331JV/Y9331TR-ND/256525
U1-4 U2-4 = ULN2003A: High-Voltage, High-Current Darlington Array; Published: 13-Oct-2000; LatestRevisionDate: 06-Jun-2005; LatestRevisionNote: Stylized 3D Model Added.; DatasheetVersion: 1998; PackageVersion: 1998; PackageReference: A16; Publisher: Altium Limited; PackageDescription: DIP; 16 Leads; Row Spacing 7.62 mm; Pitch 2.54 mm; Code_JEDEC: MS-001-BB; ComponentLink1Description: Manufacturer Link; ComponentLink1URL: http://www.allegromicro.com/

## Sheet 05-LogicOR.SchDoc
size A4; DocumentNumber: 5; SheetNumber: 5; SheetTotal: 26
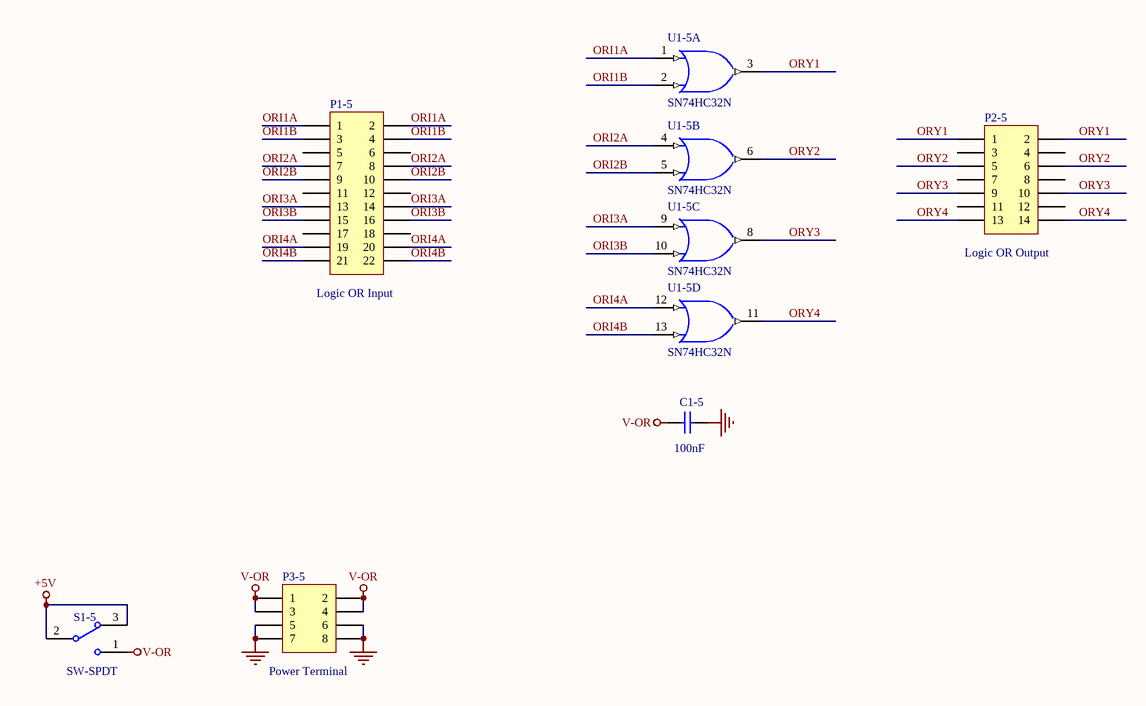
[diagram p5: 05-LogicOR.SchDoc]

### Parts
C1-5  value 100nF  [c-0805]  (hidden comment: 104)
P1-5  value Logic OR Input  [JP2.54-F-2x11A]  (hidden comment: Header 11X2)
P2-5  value Logic OR Output  [JP2.54-F-2x07A]  (hidden comment: H7X2)
P3-5  Publisher: Power Terminal  [JP2.54-F-2x04A]  (hidden comment: Header 4X2)
S1-5  SW-SPDT  [SW-SLIDE-2P-2W]
U1-5  SN74HC32N  [SK-DIP14-300]  (parts A,B,C,D of 4)

### Nets
+5V: S1-5.2 S1-5.3
GND: C1-5.2 P3-5.5 P3-5.6 P3-5.7 P3-5.8 U1-5.7(GND)
V-OR: C1-5.1 P3-5.1 P3-5.2 P3-5.3 P3-5.4 S1-5.1
VCC: U1-5.14(V-OR)
ORI1A: P1-5.1 P1-5.2 U1-5.1(A)
ORI1B: P1-5.3 P1-5.4 U1-5.2(B)
ORI2A: P1-5.7 P1-5.8 U1-5.4(A)
ORI2B: P1-5.9 P1-5.10 U1-5.5(B)
ORI3A: P1-5.13 P1-5.14 U1-5.9(A)
ORI3B: P1-5.15 P1-5.16 U1-5.10(B)
ORI4A: P1-5.19 P1-5.20 U1-5.12(A)
ORI4B: P1-5.21 P1-5.22 U1-5.13(B)
ORY1: P2-5.1 P2-5.2 U1-5.3(Y)
ORY2: P2-5.5 P2-5.6 U1-5.6(Y)
ORY3: P2-5.9 P2-5.10 U1-5.8(Y)
ORY4: P2-5.13 P2-5.14 U1-5.11(Y)

Not connected (* = marked no-connect by the designer): P1-5 5 6 11 12 17 18; P2-5 3 4 7 8 11 12

### Library data of the parts
C1-5 = Cap: Capacitor; Published: 8-Jun-2000; LatestRevisionDate: 17-Jul-2002; LatestRevisionNote: Re-released for DXP Platform.; PackageReference: RAD-0.3; Publisher: Altium Limited; PackageDescription: Radial Cap, Thru-Hole; 2 Leads; 0.3 in Pin Spacing
P1-5 = Header 11X2: Header, 11-Pin, Dual row; LatestRevisionDate: 17-Jul-2002; LatestRevisionNote: Re-released for DXP Platform.
P2-5 = Header 7X2: Header, 7-Pin, Dual row; LatestRevisionDate: 17-Jul-2002; LatestRevisionNote: Re-released for DXP Platform.
P3-5 = Header 4X2: Header, 4-Pin, Dual row; LatestRevisionDate: 17-Jul-2002; LatestRevisionNote: Re-released for DXP Platform.
S1-5 = SW-SPDT: as S1-2 on sheet 02-PowerSupply; Published: 24-Mar-1999; LatestRevisionDate: 17-Dec-2003; LatestRevisionNote: Schematic revised, PCB Footprint replaced.; DatasheetVersion: 05-Dec-2000; PackageReference: TL36WW15050; Publisher: Altium Limited; PackageDescription: Switch; 4 Leads; ComponentLink1Description: Manufacturer Link; ComponentLink1URL: http://www.apem.com
U1-5 = SN74HC32N: Quadruple 2-Input Positive-OR Gate; Published: 8-Jun-2000; LatestRevisionDate: 04-Mar-2005; LatestRevisionNote: Stylized 3D Model Added.; DatasheetVersion: May-1997; PackageVersion: Oct-1995; PackageReference: N014; Publisher: Altium Limited; PackageDescription: DIP; 14 Leads; Row Spacing 7.62 mm; Pitch 2.54 mm; ComponentLink1Description: Manufacturer Link; ComponentLink1URL: http://www.ti.com/; ComponentLink2Description: Datasheet; ComponentLink2URL: http://www-s.ti.com/sc/ds/sn74hc32.pdf

## Sheet 05-ORStatusLed.SchDoc
size A4; DocumentNumber: 5; SheetNumber: 5; SheetTotal: 26
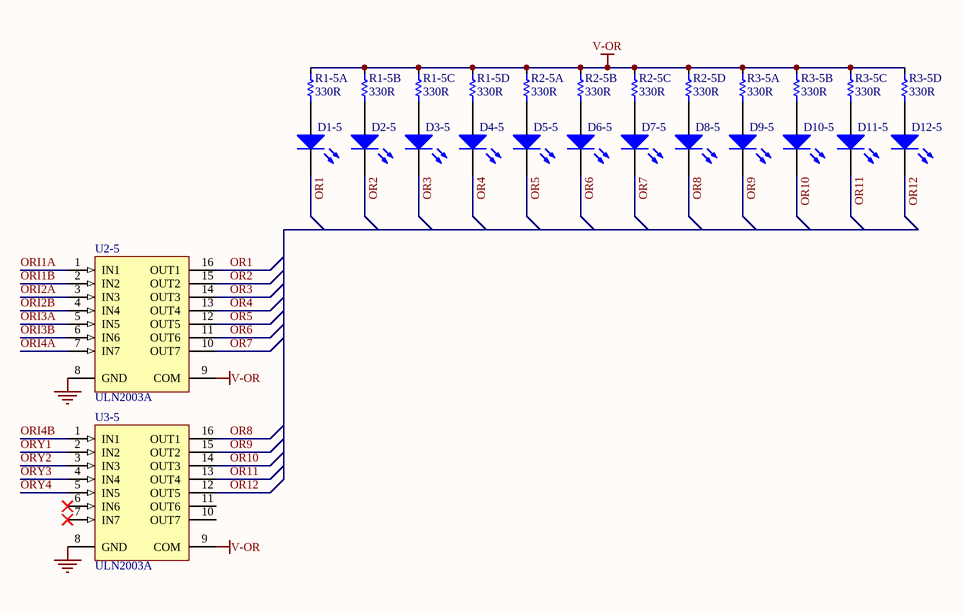
[diagram p6: 05-ORStatusLed.SchDoc]

### Parts
D1-5  LED  [LED-0805]  (value not drawn)
D2-5  LED  [LED-0805]  (value not drawn)
D3-5  LED  [LED-0805]  (value not drawn)
D4-5  LED  [LED-0805]  (value not drawn)
D5-5  LED  [LED-0805]  (value not drawn)
D6-5  LED  [LED-0805]  (value not drawn)
D7-5  LED  [LED-0805]  (value not drawn)
D8-5  LED  [LED-0805]  (value not drawn)
D9-5  LED  [LED-0805]  (value not drawn)
D10-5  LED  [LED-0805]  (value not drawn)
D11-5  LED  [LED-0805]  (value not drawn)
D12-5  LED  [LED-0805]  (value not drawn)
R1-5  330R  [R-Array-0603-4]  (parts A,B,C,D of 4)
R2-5  330R  [R-Array-0603-4]  (parts A,B,C,D of 4)
R3-5  330R  [R-Array-0603-4]  (parts A,B,C,D of 4)
U2-5  ULN2003A  [SOIC-16]
U3-5  ULN2003A  [SOIC-16]

### Nets
GND: U2-5.8(GND) U3-5.8(GND)
V-OR: R1-5.2 R1-5.4 R1-5.6 R1-5.8 R2-5.2 R2-5.4 R2-5.6 R2-5.8 R3-5.2 R3-5.4 R3-5.6 R3-5.8 U2-5.9(COM) U3-5.9(COM)
OR1: D1-5.2(K) U2-5.16(OUT1)
OR2: D2-5.2(K) U2-5.15(OUT2)
OR3: D3-5.2(K) U2-5.14(OUT3)
OR4: D4-5.2(K) U2-5.13(OUT4)
OR5: D5-5.2(K) U2-5.12(OUT5)
OR6: D6-5.2(K) U2-5.11(OUT6)
OR7: D7-5.2(K) U2-5.10(OUT7)
OR8: D8-5.2(K) U3-5.16(OUT1)
OR9: D9-5.2(K) U3-5.15(OUT2)
OR10: D10-5.2(K) U3-5.14(OUT3)
OR11: D11-5.2(K) U3-5.13(OUT4)
OR12: D12-5.2(K) U3-5.12(OUT5)
ORI1A: U2-5.1(IN1)
ORI1B: U2-5.2(IN2)
ORI2A: U2-5.3(IN3)
ORI2B: U2-5.4(IN4)
ORI3A: U2-5.5(IN5)
ORI3B: U2-5.6(IN6)
ORI4A: U2-5.7(IN7)
ORI4B: U3-5.1(IN1)
ORY1: U3-5.2(IN2)
ORY2: U3-5.3(IN3)
ORY3: U3-5.4(IN4)
ORY4: U3-5.5(IN5)
NetD1-5_1: D1-5.1(A) R1-5.1
NetD2-5_1: D2-5.1(A) R1-5.3
NetD3-5_1: D3-5.1(A) R1-5.5
NetD4-5_1: D4-5.1(A) R1-5.7
NetD5-5_1: D5-5.1(A) R2-5.1
NetD6-5_1: D6-5.1(A) R2-5.3
NetD7-5_1: D7-5.1(A) R2-5.5
NetD8-5_1: D8-5.1(A) R2-5.7
NetD9-5_1: D9-5.1(A) R3-5.1
NetD10-5_1: D10-5.1(A) R3-5.3
NetD11-5_1: D11-5.1(A) R3-5.5
NetD12-5_1: D12-5.1(A) R3-5.7

Not connected (* = marked no-connect by the designer): U3-5 6(IN6)* 7(IN7)* 10(OUT7) 11(OUT6)

### Library data of the parts
D1-5 D2-5 D3-5 D4-5 D5-5 D6-5 D7-5 D8-5 D9-5 D10-5 D11-5 D12-5 = LED2: as D1-4 on sheet 04-ANDStatusLed; Published: 8-Jun-2000; LatestRevisionDate: 17-Jul-2002; LatestRevisionNote: Re-released for DXP Platform.; PackageVersion: Feb-2002; PackageReference: 3.2X1.6X1.1; Publisher: Altium Limited; PackageDescription: SM LED; 2 Flat Leads
R1-5 R2-5 R3-5 = Res Array 4: as R1-4 on sheet 04-ANDStatusLed; Digi-Key Part Number: Y9331TR-ND; Link: http://www.digikey.com/product-detail/en/EXB-38V331JV/Y9331TR-ND/256525
U2-5 U3-5 = ULN2003A: as U1-4 on sheet 04-ANDStatusLed; Published: 13-Oct-2000; LatestRevisionDate: 06-Jun-2005; LatestRevisionNote: Stylized 3D Model Added.; DatasheetVersion: 1998; PackageVersion: 1998; PackageReference: A16; Publisher: Altium Limited; PackageDescription: DIP; 16 Leads; Row Spacing 7.62 mm; Pitch 2.54 mm; Code_JEDEC: MS-001-BB; ComponentLink1Description: Manufacturer Link; ComponentLink1URL: http://www.allegromicro.com/

## Sheet 06-LogicNOT.SchDoc
size A4; DocumentNumber: 6; SheetNumber: 6; SheetTotal: 26
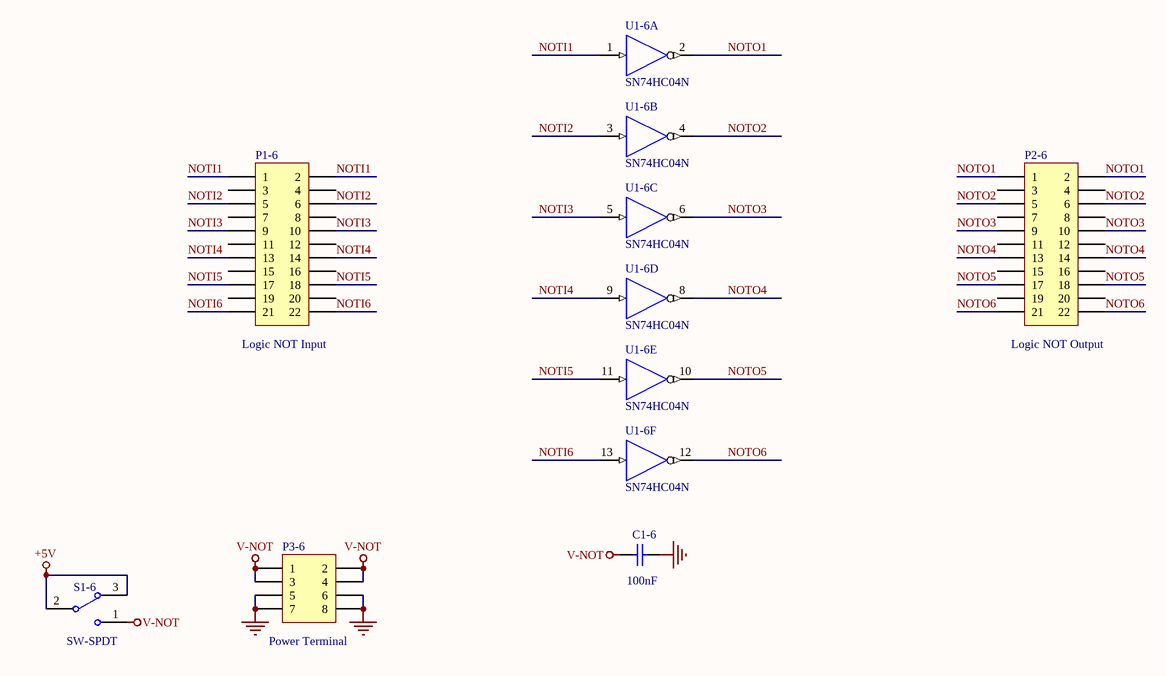
[diagram p7: 06-LogicNOT.SchDoc]

### Parts
C1-6  value 100nF  [c-0805]  (hidden comment: 104)
P1-6  value Logic NOT Input  [JP2.54-F-2x11A]  (hidden comment: Header 11X2)
P2-6  value Logic NOT Output  [JP2.54-F-2x11A]  (hidden comment: Header 11X2)
P3-6  Publisher: Power Terminal  [JP2.54-F-2x04A]  (hidden comment: Header 4X2)
S1-6  SW-SPDT  [SW-SLIDE-2P-2W]
U1-6  SN74HC04N  [SK-DIP14-300]  (parts A,B,C,D,E,F of 6)

### Nets
+5V: S1-6.2 S1-6.3
GND: C1-6.2 P3-6.5 P3-6.6 P3-6.7 P3-6.8 U1-6.7(GND)
V-NOT: C1-6.1 P3-6.1 P3-6.2 P3-6.3 P3-6.4 S1-6.1
VCC: U1-6.14(V-NOT)
NOTI1: P1-6.1 P1-6.2 U1-6.1(A)
NOTI2: P1-6.5 P1-6.6 U1-6.3(A)
NOTI3: P1-6.9 P1-6.10 U1-6.5(A)
NOTI4: P1-6.13 P1-6.14 U1-6.9(A)
NOTI5: P1-6.17 P1-6.18 U1-6.11(A)
NOTI6: P1-6.21 P1-6.22 U1-6.13(A)
NOTO1: P2-6.1 P2-6.2 U1-6.2(Y)
NOTO2: P2-6.5 P2-6.6 U1-6.4(Y)
NOTO3: P2-6.9 P2-6.10 U1-6.6(Y)
NOTO4: P2-6.13 P2-6.14 U1-6.8(Y)
NOTO5: P2-6.17 P2-6.18 U1-6.10(Y)
NOTO6: P2-6.21 P2-6.22 U1-6.12(Y)

Not connected (* = marked no-connect by the designer): P1-6 3 4 7 8 11 12 15 16 19 20; P2-6 3 4 7 8 11 12 15 16 19 20

### Library data of the parts
C1-6 = Cap: Capacitor; Published: 8-Jun-2000; LatestRevisionDate: 17-Jul-2002; LatestRevisionNote: Re-released for DXP Platform.; PackageReference: RAD-0.3; Publisher: Altium Limited; PackageDescription: Radial Cap, Thru-Hole; 2 Leads; 0.3 in Pin Spacing
P1-6 P2-6 = Header 11X2: Header, 11-Pin, Dual row; LatestRevisionDate: 17-Jul-2002; LatestRevisionNote: Re-released for DXP Platform.
P3-6 = Header 4X2: Header, 4-Pin, Dual row; LatestRevisionDate: 17-Jul-2002; LatestRevisionNote: Re-released for DXP Platform.
S1-6 = SW-SPDT: as S1-2 on sheet 02-PowerSupply; Published: 24-Mar-1999; LatestRevisionDate: 17-Dec-2003; LatestRevisionNote: Schematic revised, PCB Footprint replaced.; DatasheetVersion: 05-Dec-2000; PackageReference: TL36WW15050; Publisher: Altium Limited; PackageDescription: Switch; 4 Leads; ComponentLink1Description: Manufacturer Link; ComponentLink1URL: http://www.apem.com
U1-6 = SN74HC04N: Hex Inverter; Published: 8-Jun-2000; LatestRevisionDate: 04-Mar-2005; LatestRevisionNote: Stylized 3D Model Added.; DatasheetVersion: May-1997; PackageVersion: Oct-1995; PackageReference: N014; Publisher: Altium Limited; PackageDescription: DIP; 14 Leads; Row Spacing 7.62 mm; Pitch 2.54 mm; ComponentLink1Description: Manufacturer Link; ComponentLink1URL: http://www.ti.com/; ComponentLink2Description: Datasheet; ComponentLink2URL: http://www-s.ti.com/sc/ds/sn74hc04.pdf

## Sheet 06-NOTStatusLed.SchDoc
size A4; DocumentNumber: 6; SheetNumber: 6; SheetTotal: 26
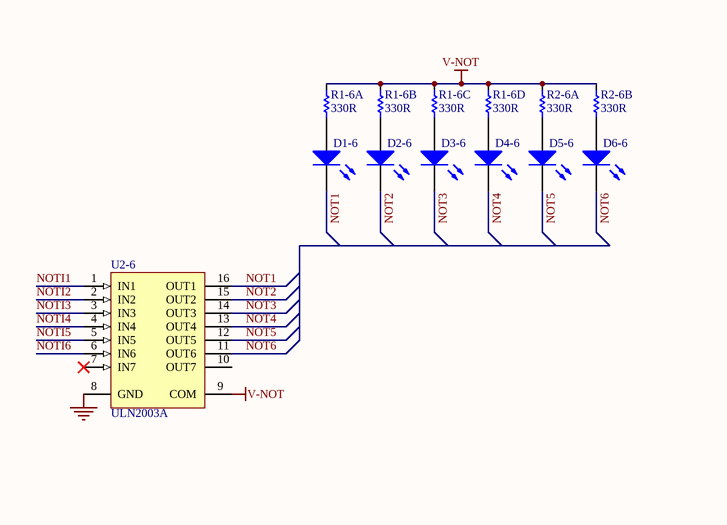
[diagram p8: 06-NOTStatusLed.SchDoc, left]
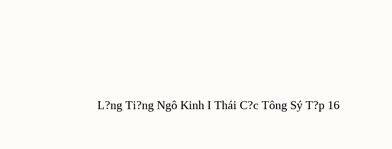
[diagram p9: 06-NOTStatusLed.SchDoc, right]

### Parts
D1-6  LED  [LED-0805]  (value not drawn)
D2-6  LED  [LED-0805]  (value not drawn)
D3-6  LED  [LED-0805]  (value not drawn)
D4-6  LED  [LED-0805]  (value not drawn)
D5-6  LED  [LED-0805]  (value not drawn)
D6-6  LED  [LED-0805]  (value not drawn)
R1-6  330R  [R-Array-0603-4]  (parts A,B,C,D of 4)
R2-6  330R  [R-Array-0603-4]  (parts A,B of 4)
U2-6  ULN2003A  [SOIC-16]

### Nets
GND: U2-6.8(GND)
V-NOT: R1-6.2 R1-6.4 R1-6.6 R1-6.8 R2-6.2 R2-6.4 U2-6.9(COM)
NOT1: D1-6.2(K) U2-6.16(OUT1)
NOT2: D2-6.2(K) U2-6.15(OUT2)
NOT3: D3-6.2(K) U2-6.14(OUT3)
NOT4: D4-6.2(K) U2-6.13(OUT4)
NOT5: D5-6.2(K) U2-6.12(OUT5)
NOT6: D6-6.2(K) U2-6.11(OUT6)
NOTI1: U2-6.1(IN1)
NOTI2: U2-6.2(IN2)
NOTI3: U2-6.3(IN3)
NOTI4: U2-6.4(IN4)
NOTI5: U2-6.5(IN5)
NOTI6: U2-6.6(IN6)
NetD1-6_1: D1-6.1(A) R1-6.1
NetD2-6_1: D2-6.1(A) R1-6.3
NetD3-6_1: D3-6.1(A) R1-6.5
NetD4-6_1: D4-6.1(A) R1-6.7
NetD5-6_1: D5-6.1(A) R2-6.1
NetD6-6_1: D6-6.1(A) R2-6.3

Not connected (* = marked no-connect by the designer): U2-6 7(IN7)* 10(OUT7)

### Notes on the sheet
- L?ng Ti?ng Ngô Kinh I Thái C?c Tông Sý T?p 16

### Library data of the parts
D1-6 D2-6 D3-6 D4-6 D5-6 D6-6 = LED2: as D1-4 on sheet 04-ANDStatusLed; Published: 8-Jun-2000; LatestRevisionDate: 17-Jul-2002; LatestRevisionNote: Re-released for DXP Platform.; PackageVersion: Feb-2002; PackageReference: 3.2X1.6X1.1; Publisher: Altium Limited; PackageDescription: SM LED; 2 Flat Leads
R1-6 R2-6 = Res Array 4: as R1-4 on sheet 04-ANDStatusLed; Digi-Key Part Number: Y9331TR-ND; Link: http://www.digikey.com/product-detail/en/EXB-38V331JV/Y9331TR-ND/256525
U2-6 = ULN2003A: as U1-4 on sheet 04-ANDStatusLed; Published: 13-Oct-2000; LatestRevisionDate: 06-Jun-2005; LatestRevisionNote: Stylized 3D Model Added.; DatasheetVersion: 1998; PackageVersion: 1998; PackageReference: A16; Publisher: Altium Limited; PackageDescription: DIP; 16 Leads; Row Spacing 7.62 mm; Pitch 2.54 mm; Code_JEDEC: MS-001-BB; ComponentLink1Description: Manufacturer Link; ComponentLink1URL: http://www.allegromicro.com/

## Sheet 07-LogicXOR.SchDoc
size A4; DocumentNumber: 7; SheetNumber: 7; SheetTotal: 26
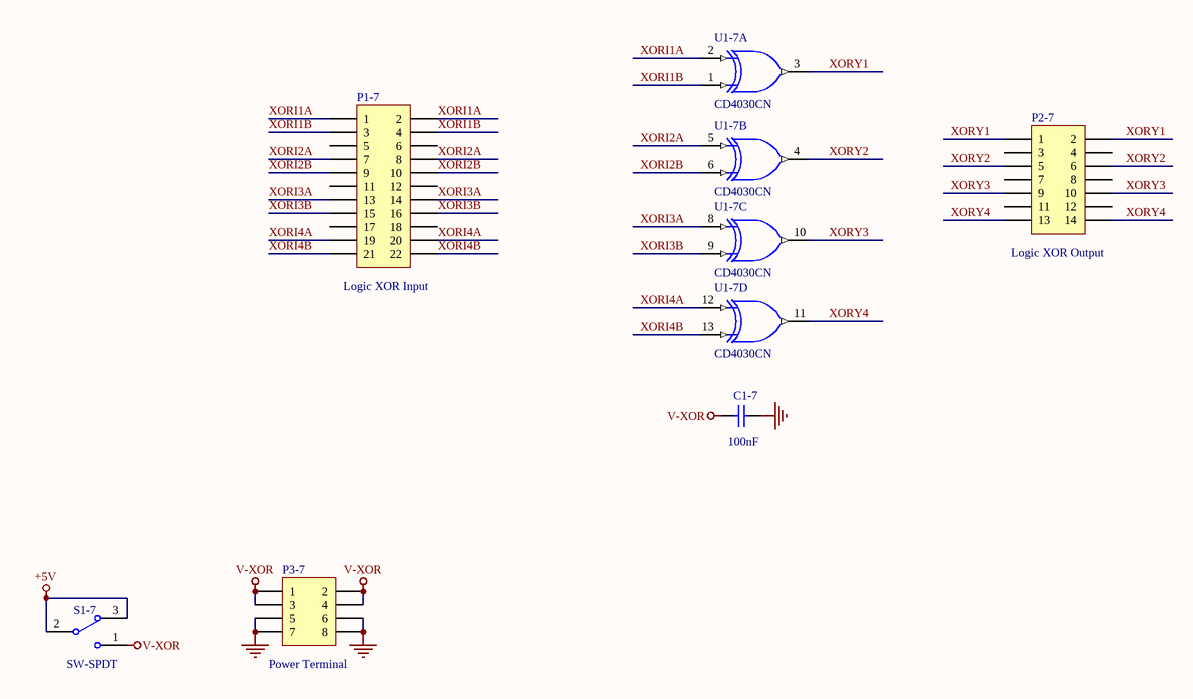
[diagram p10: 07-LogicXOR.SchDoc]

### Parts
C1-7  value 100nF  [c-0805]  (hidden comment: 104)
P1-7  value Logic XOR Input  [JP2.54-F-2x11A]  (hidden comment: Header 11X2)
P2-7  value Logic XOR Output  [JP2.54-F-2x07A]  (hidden comment: H7X2)
P3-7  Publisher: Power Terminal  [JP2.54-F-2x04A]  (hidden comment: Header 4X2)
S1-7  SW-SPDT  [SW-SLIDE-2P-2W]
U1-7  CD4030CN  [SK-DIP14-300]  (parts A,B,C,D of 4)

### Nets
+5V: S1-7.2 S1-7.3
GND: C1-7.2 P3-7.5 P3-7.6 P3-7.7 P3-7.8 U1-7.7(GND)
V-XOR: C1-7.1 P3-7.1 P3-7.2 P3-7.3 P3-7.4 S1-7.1
VDD: U1-7.14(V-XOR)
XORI1A: P1-7.1 P1-7.2 U1-7.2(A)
XORI1B: P1-7.3 P1-7.4 U1-7.1(B)
XORI2A: P1-7.7 P1-7.8 U1-7.5(A)
XORI2B: P1-7.9 P1-7.10 U1-7.6(B)
XORI3A: P1-7.13 P1-7.14 U1-7.8(A)
XORI3B: P1-7.15 P1-7.16 U1-7.9(B)
XORI4A: P1-7.19 P1-7.20 U1-7.12(A)
XORI4B: P1-7.21 P1-7.22 U1-7.13(B)
XORY1: P2-7.1 P2-7.2 U1-7.3(J)
XORY2: P2-7.5 P2-7.6 U1-7.4(J)
XORY3: P2-7.9 P2-7.10 U1-7.10(J)
XORY4: P2-7.13 P2-7.14 U1-7.11(J)

Not connected (* = marked no-connect by the designer): P1-7 5 6 11 12 17 18; P2-7 3 4 7 8 11 12

### Library data of the parts
C1-7 = Cap: Capacitor; Published: 8-Jun-2000; LatestRevisionDate: 17-Jul-2002; LatestRevisionNote: Re-released for DXP Platform.; PackageReference: RAD-0.3; Publisher: Altium Limited; PackageDescription: Radial Cap, Thru-Hole; 2 Leads; 0.3 in Pin Spacing
P1-7 = Header 11X2: Header, 11-Pin, Dual row; LatestRevisionDate: 17-Jul-2002; LatestRevisionNote: Re-released for DXP Platform.
P2-7 = Header 7X2: Header, 7-Pin, Dual row; LatestRevisionDate: 17-Jul-2002; LatestRevisionNote: Re-released for DXP Platform.
P3-7 = Header 4X2: Header, 4-Pin, Dual row; LatestRevisionDate: 17-Jul-2002; LatestRevisionNote: Re-released for DXP Platform.
S1-7 = SW-SPDT: as S1-2 on sheet 02-PowerSupply; Published: 24-Mar-1999; LatestRevisionDate: 17-Dec-2003; LatestRevisionNote: Schematic revised, PCB Footprint replaced.; DatasheetVersion: 05-Dec-2000; PackageReference: TL36WW15050; Publisher: Altium Limited; PackageDescription: Switch; 4 Leads; ComponentLink1Description: Manufacturer Link; ComponentLink1URL: http://www.apem.com
U1-7 = CD4030CN: Quad Exclusive OR Gate, 14-Pin PDIP; IC_Technology: C; Published: 17-Jul-2002; LatestRevisionDate: 29-May-2009; LatestRevisionNote: Component Body Added.; DatasheetVersion: Jan-1999; PackageVersion: 2000; PackageReference: N14A; Publisher: Altium Limited; PackageDescription: DIP, 14-Pin, Row Spacing 7.62 mm, Pitch 2.54 mm; ComponentLink1Description: Manufacturer Link; ComponentLink1URL: http://www.fairchildsemi.com/

## Sheet 07-XORStatusLed.SchDoc
size A4; DocumentNumber: 7; SheetNumber: 7; SheetTotal: 26
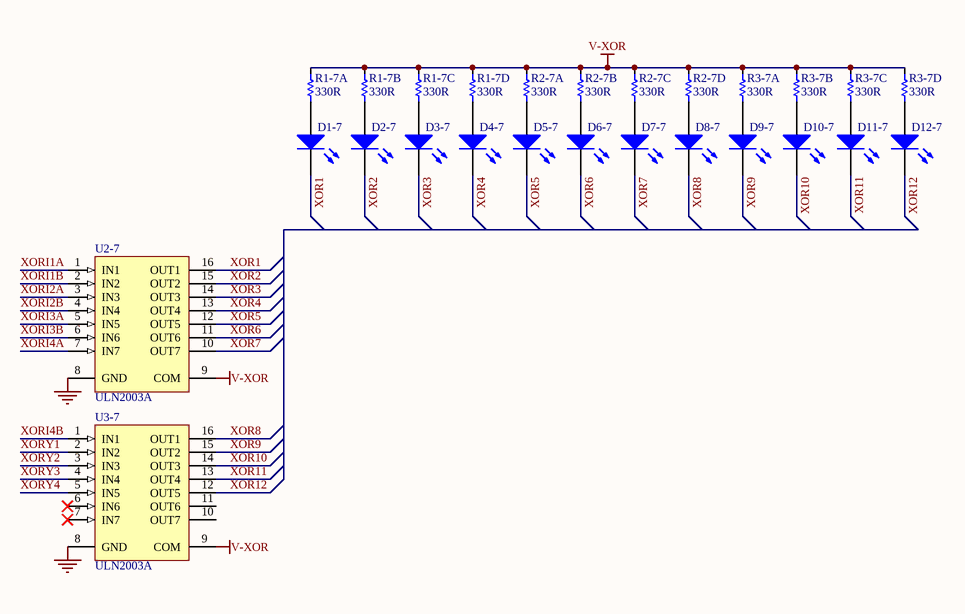
[diagram p11: 07-XORStatusLed.SchDoc]

### Parts
D1-7  LED  [LED-0805]  (value not drawn)
D2-7  LED  [LED-0805]  (value not drawn)
D3-7  LED  [LED-0805]  (value not drawn)
D4-7  LED  [LED-0805]  (value not drawn)
D5-7  LED  [LED-0805]  (value not drawn)
D6-7  LED  [LED-0805]  (value not drawn)
D7-7  LED  [LED-0805]  (value not drawn)
D8-7  LED  [LED-0805]  (value not drawn)
D9-7  LED  [LED-0805]  (value not drawn)
D10-7  LED  [LED-0805]  (value not drawn)
D11-7  LED  [LED-0805]  (value not drawn)
D12-7  LED  [LED-0805]  (value not drawn)
R1-7  330R  [R-Array-0603-4]  (parts A,B,C,D of 4)
R2-7  330R  [R-Array-0603-4]  (parts A,B,C,D of 4)
R3-7  330R  [R-Array-0603-4]  (parts A,B,C,D of 4)
U2-7  ULN2003A  [SOIC-16]
U3-7  ULN2003A  [SOIC-16]

### Nets
GND: U2-7.8(GND) U3-7.8(GND)
V-XOR: R1-7.2 R1-7.4 R1-7.6 R1-7.8 R2-7.2 R2-7.4 R2-7.6 R2-7.8 R3-7.2 R3-7.4 R3-7.6 R3-7.8 U2-7.9(COM) U3-7.9(COM)
XOR1: D1-7.2(K) U2-7.16(OUT1)
XOR2: D2-7.2(K) U2-7.15(OUT2)
XOR3: D3-7.2(K) U2-7.14(OUT3)
XOR4: D4-7.2(K) U2-7.13(OUT4)
XOR5: D5-7.2(K) U2-7.12(OUT5)
XOR6: D6-7.2(K) U2-7.11(OUT6)
XOR7: D7-7.2(K) U2-7.10(OUT7)
XOR8: D8-7.2(K) U3-7.16(OUT1)
XOR9: D9-7.2(K) U3-7.15(OUT2)
XOR10: D10-7.2(K) U3-7.14(OUT3)
XOR11: D11-7.2(K) U3-7.13(OUT4)
XOR12: D12-7.2(K) U3-7.12(OUT5)
XORI1A: U2-7.1(IN1)
XORI1B: U2-7.2(IN2)
XORI2A: U2-7.3(IN3)
XORI2B: U2-7.4(IN4)
XORI3A: U2-7.5(IN5)
XORI3B: U2-7.6(IN6)
XORI4A: U2-7.7(IN7)
XORI4B: U3-7.1(IN1)
XORY1: U3-7.2(IN2)
XORY2: U3-7.3(IN3)
XORY3: U3-7.4(IN4)
XORY4: U3-7.5(IN5)
NetD1-7_1: D1-7.1(A) R1-7.1
NetD2-7_1: D2-7.1(A) R1-7.3
NetD3-7_1: D3-7.1(A) R1-7.5
NetD4-7_1: D4-7.1(A) R1-7.7
NetD5-7_1: D5-7.1(A) R2-7.1
NetD6-7_1: D6-7.1(A) R2-7.3
NetD7-7_1: D7-7.1(A) R2-7.5
NetD8-7_1: D8-7.1(A) R2-7.7
NetD9-7_1: D9-7.1(A) R3-7.1
NetD10-7_1: D10-7.1(A) R3-7.3
NetD11-7_1: D11-7.1(A) R3-7.5
NetD12-7_1: D12-7.1(A) R3-7.7

Not connected (* = marked no-connect by the designer): U3-7 6(IN6)* 7(IN7)* 10(OUT7) 11(OUT6)

### Library data of the parts
D1-7 D2-7 D3-7 D4-7 D5-7 D6-7 D7-7 D8-7 D9-7 D10-7 D11-7 D12-7 = LED2: as D1-4 on sheet 04-ANDStatusLed; Published: 8-Jun-2000; LatestRevisionDate: 17-Jul-2002; LatestRevisionNote: Re-released for DXP Platform.; PackageVersion: Feb-2002; PackageReference: 3.2X1.6X1.1; Publisher: Altium Limited; PackageDescription: SM LED; 2 Flat Leads
R1-7 R2-7 R3-7 = Res Array 4: as R1-4 on sheet 04-ANDStatusLed; Digi-Key Part Number: Y9331TR-ND; Link: http://www.digikey.com/product-detail/en/EXB-38V331JV/Y9331TR-ND/256525
U2-7 U3-7 = ULN2003A: as U1-4 on sheet 04-ANDStatusLed; Published: 13-Oct-2000; LatestRevisionDate: 06-Jun-2005; LatestRevisionNote: Stylized 3D Model Added.; DatasheetVersion: 1998; PackageVersion: 1998; PackageReference: A16; Publisher: Altium Limited; PackageDescription: DIP; 16 Leads; Row Spacing 7.62 mm; Pitch 2.54 mm; Code_JEDEC: MS-001-BB; ComponentLink1Description: Manufacturer Link; ComponentLink1URL: http://www.allegromicro.com/

## Sheet 08-LogicNAND.SchDoc
size A4; DocumentNumber: 8; SheetNumber: 8; SheetTotal: 26
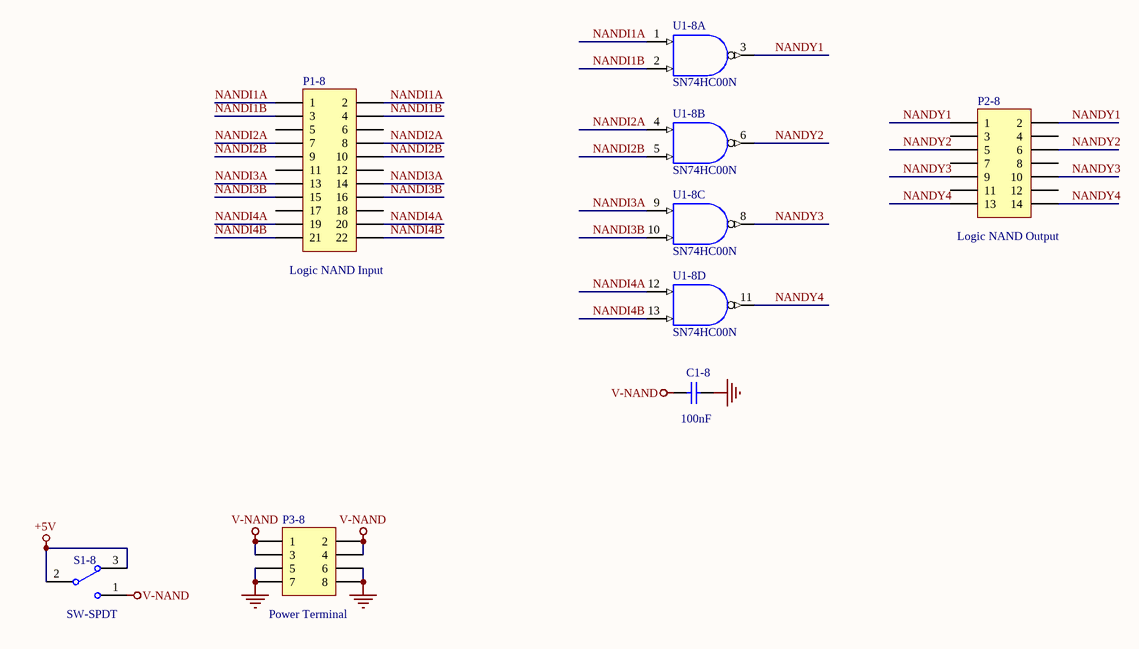
[diagram p12: 08-LogicNAND.SchDoc]

### Parts
C1-8  value 100nF  [c-0805]  (hidden comment: 104)
P1-8  value Logic NAND Input  [JP2.54-F-2x11A]  (hidden comment: Header 11X2)
P2-8  value Logic NAND Output  [JP2.54-F-2x07A]  (hidden comment: H7X2)
P3-8  Publisher: Power Terminal  [JP2.54-F-2x04A]  (hidden comment: Header 4X2)
S1-8  SW-SPDT  [SW-SLIDE-2P-2W]
U1-8  SN74HC00N  [SK-DIP14-300]  (parts A,B,C,D of 4)

### Nets
+5V: S1-8.2 S1-8.3
GND: C1-8.2 P3-8.5 P3-8.6 P3-8.7 P3-8.8 U1-8.7(GND)
V-NAND: C1-8.1 P3-8.1 P3-8.2 P3-8.3 P3-8.4 S1-8.1 U1-8.14(V-NAND)
NANDI1A: P1-8.1 P1-8.2 U1-8.1(A)
NANDI1B: P1-8.3 P1-8.4 U1-8.2(B)
NANDI2A: P1-8.7 P1-8.8 U1-8.4(A)
NANDI2B: P1-8.9 P1-8.10 U1-8.5(B)
NANDI3A: P1-8.13 P1-8.14 U1-8.9(A)
NANDI3B: P1-8.15 P1-8.16 U1-8.10(B)
NANDI4A: P1-8.19 P1-8.20 U1-8.12(A)
NANDI4B: P1-8.21 P1-8.22 U1-8.13(B)
NANDY1: P2-8.1 P2-8.2 U1-8.3(Y)
NANDY2: P2-8.5 P2-8.6 U1-8.6(Y)
NANDY3: P2-8.9 P2-8.10 U1-8.8(Y)
NANDY4: P2-8.13 P2-8.14 U1-8.11(Y)

Not connected (* = marked no-connect by the designer): P1-8 5 6 11 12 17 18; P2-8 3 4 7 8 11 12

### Library data of the parts
C1-8 = Cap: Capacitor; Published: 8-Jun-2000; LatestRevisionDate: 17-Jul-2002; LatestRevisionNote: Re-released for DXP Platform.; PackageReference: RAD-0.3; Publisher: Altium Limited; PackageDescription: Radial Cap, Thru-Hole; 2 Leads; 0.3 in Pin Spacing
P1-8 = Header 11X2: Header, 11-Pin, Dual row; LatestRevisionDate: 17-Jul-2002; LatestRevisionNote: Re-released for DXP Platform.
P2-8 = Header 7X2: Header, 7-Pin, Dual row; LatestRevisionDate: 17-Jul-2002; LatestRevisionNote: Re-released for DXP Platform.
P3-8 = Header 4X2: Header, 4-Pin, Dual row; LatestRevisionDate: 17-Jul-2002; LatestRevisionNote: Re-released for DXP Platform.
S1-8 = SW-SPDT: as S1-2 on sheet 02-PowerSupply; Published: 24-Mar-1999; LatestRevisionDate: 17-Dec-2003; LatestRevisionNote: Schematic revised, PCB Footprint replaced.; DatasheetVersion: 05-Dec-2000; PackageReference: TL36WW15050; Publisher: Altium Limited; PackageDescription: Switch; 4 Leads; ComponentLink1Description: Manufacturer Link; ComponentLink1URL: http://www.apem.com
U1-8 = SN74HC00N: Quadruple 2-Input Positive-NAND Gate; Published: 8-Jun-2000; LatestRevisionDate: 04-Mar-2005; LatestRevisionNote: Stylized 3D Model Added.; DatasheetVersion: May-1997; PackageVersion: Oct-1995; PackageReference: N014; Publisher: Altium Limited; PackageDescription: DIP; 14 Leads; Row Spacing 7.62 mm; Pitch 2.54 mm; ComponentLink1Description: Manufacturer Link; ComponentLink1URL: http://www.ti.com/; ComponentLink2Description: Datasheet; ComponentLink2URL: http://www-s.ti.com/sc/ds/sn74hc00.pdf

## Sheet 08-NANDStatusLed.SchDoc
size A4; DocumentNumber: 8; SheetNumber: 8; SheetTotal: 26
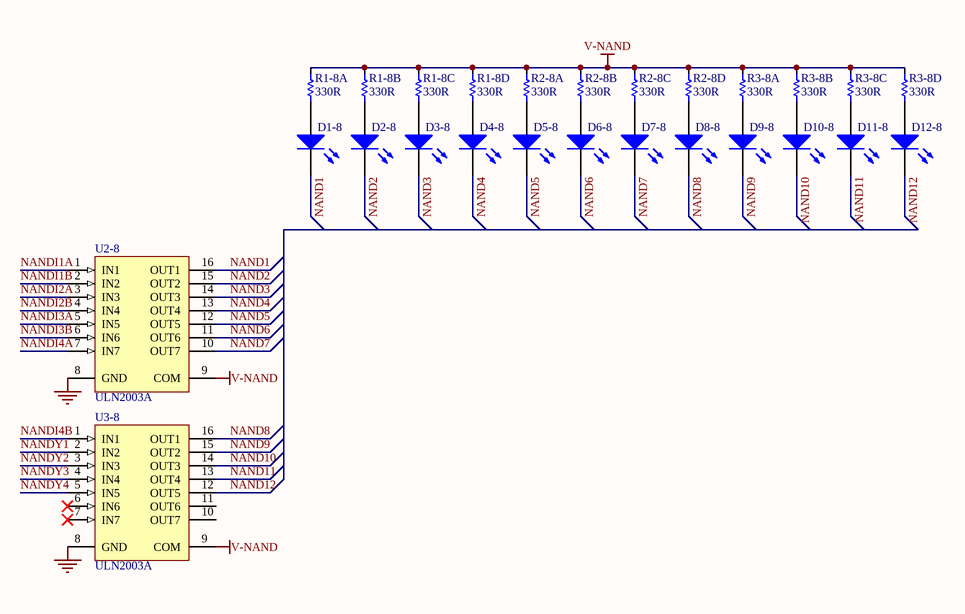
[diagram p13: 08-NANDStatusLed.SchDoc]

### Parts
D1-8  LED  [LED-0805]  (value not drawn)
D2-8  LED  [LED-0805]  (value not drawn)
D3-8  LED  [LED-0805]  (value not drawn)
D4-8  LED  [LED-0805]  (value not drawn)
D5-8  LED  [LED-0805]  (value not drawn)
D6-8  LED  [LED-0805]  (value not drawn)
D7-8  LED  [LED-0805]  (value not drawn)
D8-8  LED  [LED-0805]  (value not drawn)
D9-8  LED  [LED-0805]  (value not drawn)
D10-8  LED  [LED-0805]  (value not drawn)
D11-8  LED  [LED-0805]  (value not drawn)
D12-8  LED  [LED-0805]  (value not drawn)
R1-8  330R  [R-Array-0603-4]  (parts A,B,C,D of 4)
R2-8  330R  [R-Array-0603-4]  (parts A,B,C,D of 4)
R3-8  330R  [R-Array-0603-4]  (parts A,B,C,D of 4)
U2-8  ULN2003A  [SOIC-16]
U3-8  ULN2003A  [SOIC-16]

### Nets
GND: U2-8.8(GND) U3-8.8(GND)
V-NAND: R1-8.2 R1-8.4 R1-8.6 R1-8.8 R2-8.2 R2-8.4 R2-8.6 R2-8.8 R3-8.2 R3-8.4 R3-8.6 R3-8.8 U2-8.9(COM) U3-8.9(COM)
NAND1: D1-8.2(K) U2-8.16(OUT1)
NAND2: D2-8.2(K) U2-8.15(OUT2)
NAND3: D3-8.2(K) U2-8.14(OUT3)
NAND4: D4-8.2(K) U2-8.13(OUT4)
NAND5: D5-8.2(K) U2-8.12(OUT5)
NAND6: D6-8.2(K) U2-8.11(OUT6)
NAND7: D7-8.2(K) U2-8.10(OUT7)
NAND8: D8-8.2(K) U3-8.16(OUT1)
NAND9: D9-8.2(K) U3-8.15(OUT2)
NAND10: D10-8.2(K) U3-8.14(OUT3)
NAND11: D11-8.2(K) U3-8.13(OUT4)
NAND12: D12-8.2(K) U3-8.12(OUT5)
NANDI1A: U2-8.1(IN1)
NANDI1B: U2-8.2(IN2)
NANDI2A: U2-8.3(IN3)
NANDI2B: U2-8.4(IN4)
NANDI3A: U2-8.5(IN5)
NANDI3B: U2-8.6(IN6)
NANDI4A: U2-8.7(IN7)
NANDI4B: U3-8.1(IN1)
NANDY1: U3-8.2(IN2)
NANDY2: U3-8.3(IN3)
NANDY3: U3-8.4(IN4)
NANDY4: U3-8.5(IN5)
NetD1-8_1: D1-8.1(A) R1-8.1
NetD2-8_1: D2-8.1(A) R1-8.3
NetD3-8_1: D3-8.1(A) R1-8.5
NetD4-8_1: D4-8.1(A) R1-8.7
NetD5-8_1: D5-8.1(A) R2-8.1
NetD6-8_1: D6-8.1(A) R2-8.3
NetD7-8_1: D7-8.1(A) R2-8.5
NetD8-8_1: D8-8.1(A) R2-8.7
NetD9-8_1: D9-8.1(A) R3-8.1
NetD10-8_1: D10-8.1(A) R3-8.3
NetD11-8_1: D11-8.1(A) R3-8.5
NetD12-8_1: D12-8.1(A) R3-8.7

Not connected (* = marked no-connect by the designer): U3-8 6(IN6)* 7(IN7)* 10(OUT7) 11(OUT6)

### Library data of the parts
D1-8 D2-8 D3-8 D4-8 D5-8 D6-8 D7-8 D8-8 D9-8 D10-8 D11-8 D12-8 = LED2: as D1-4 on sheet 04-ANDStatusLed; Published: 8-Jun-2000; LatestRevisionDate: 17-Jul-2002; LatestRevisionNote: Re-released for DXP Platform.; PackageVersion: Feb-2002; PackageReference: 3.2X1.6X1.1; Publisher: Altium Limited; PackageDescription: SM LED; 2 Flat Leads
R1-8 R2-8 R3-8 = Res Array 4: as R1-4 on sheet 04-ANDStatusLed; Digi-Key Part Number: Y9331TR-ND; Link: http://www.digikey.com/product-detail/en/EXB-38V331JV/Y9331TR-ND/256525
U2-8 U3-8 = ULN2003A: as U1-4 on sheet 04-ANDStatusLed; Published: 13-Oct-2000; LatestRevisionDate: 06-Jun-2005; LatestRevisionNote: Stylized 3D Model Added.; DatasheetVersion: 1998; PackageVersion: 1998; PackageReference: A16; Publisher: Altium Limited; PackageDescription: DIP; 16 Leads; Row Spacing 7.62 mm; Pitch 2.54 mm; Code_JEDEC: MS-001-BB; ComponentLink1Description: Manufacturer Link; ComponentLink1URL: http://www.allegromicro.com/

## Sheet 09-LogicNOR.SchDoc
size A4; DocumentNumber: 9; SheetNumber: 9; SheetTotal: 26
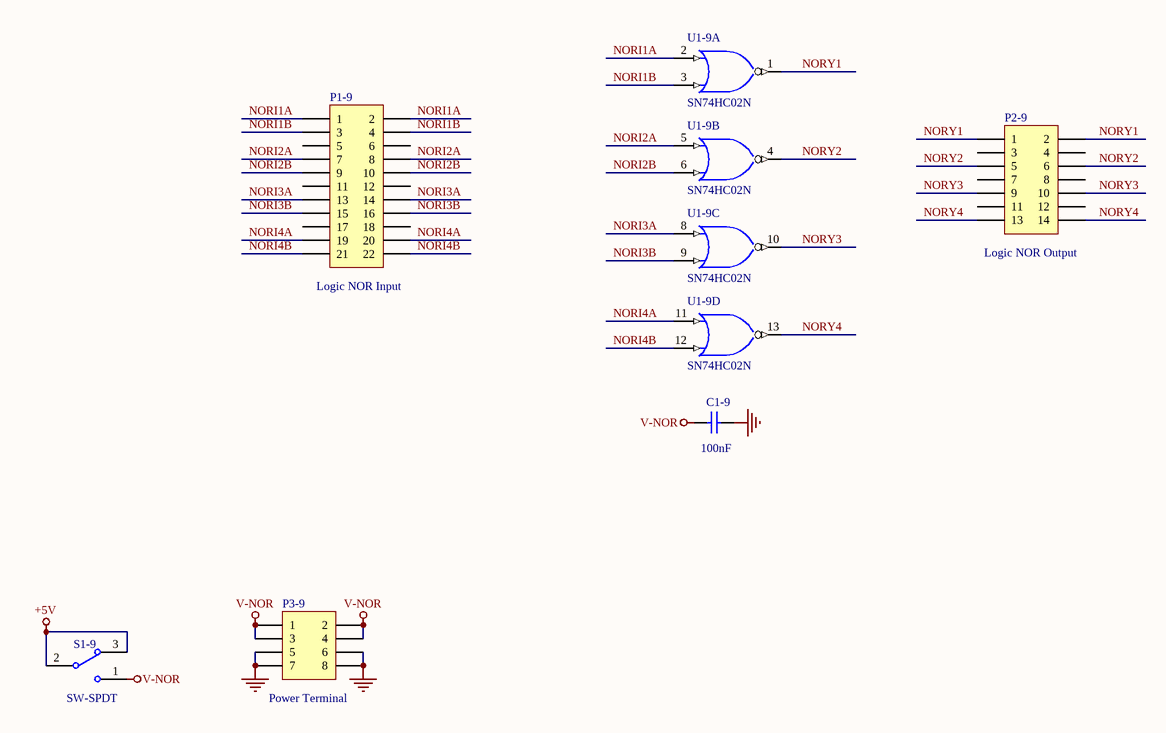
[diagram p14: 09-LogicNOR.SchDoc]

### Parts
C1-9  value 100nF  [c-0805]  (hidden comment: 104)
P1-9  value Logic NOR Input  [JP2.54-F-2x11A]  (hidden comment: Header 11X2)
P2-9  value Logic NOR Output  [JP2.54-F-2x07A]  (hidden comment: H7X2)
P3-9  Publisher: Power Terminal  [JP2.54-F-2x04A]  (hidden comment: Header 4X2)
S1-9  SW-SPDT  [SW-SLIDE-2P-2W]
U1-9  SN74HC02N  [SK-DIP14-300]  (parts A,B,C,D of 4)

### Nets
+5V: S1-9.2 S1-9.3
GND: C1-9.2 P3-9.5 P3-9.6 P3-9.7 P3-9.8 U1-9.7(GND)
V-NOR: C1-9.1 P3-9.1 P3-9.2 P3-9.3 P3-9.4 S1-9.1
VCC: U1-9.14(V-NOR)
NORI1A: P1-9.1 P1-9.2 U1-9.2(A)
NORI1B: P1-9.3 P1-9.4 U1-9.3(B)
NORI2A: P1-9.7 P1-9.8 U1-9.5(A)
NORI2B: P1-9.9 P1-9.10 U1-9.6(B)
NORI3A: P1-9.13 P1-9.14 U1-9.8(A)
NORI3B: P1-9.15 P1-9.16 U1-9.9(B)
NORI4A: P1-9.19 P1-9.20 U1-9.11(A)
NORI4B: P1-9.21 P1-9.22 U1-9.12(B)
NORY1: P2-9.1 P2-9.2 U1-9.1(Y)
NORY2: P2-9.5 P2-9.6 U1-9.4(Y)
NORY3: P2-9.9 P2-9.10 U1-9.10(Y)
NORY4: P2-9.13 P2-9.14 U1-9.13(Y)

Not connected (* = marked no-connect by the designer): P1-9 5 6 11 12 17 18; P2-9 3 4 7 8 11 12

### Library data of the parts
C1-9 = Cap: Capacitor; Published: 8-Jun-2000; LatestRevisionDate: 17-Jul-2002; LatestRevisionNote: Re-released for DXP Platform.; PackageReference: RAD-0.3; Publisher: Altium Limited; PackageDescription: Radial Cap, Thru-Hole; 2 Leads; 0.3 in Pin Spacing
P1-9 = Header 11X2: Header, 11-Pin, Dual row; LatestRevisionDate: 17-Jul-2002; LatestRevisionNote: Re-released for DXP Platform.
P2-9 = Header 7X2: Header, 7-Pin, Dual row; LatestRevisionDate: 17-Jul-2002; LatestRevisionNote: Re-released for DXP Platform.
P3-9 = Header 4X2: Header, 4-Pin, Dual row; LatestRevisionDate: 17-Jul-2002; LatestRevisionNote: Re-released for DXP Platform.
S1-9 = SW-SPDT: as S1-2 on sheet 02-PowerSupply; Published: 24-Mar-1999; LatestRevisionDate: 17-Dec-2003; LatestRevisionNote: Schematic revised, PCB Footprint replaced.; DatasheetVersion: 05-Dec-2000; PackageReference: TL36WW15050; Publisher: Altium Limited; PackageDescription: Switch; 4 Leads; ComponentLink1Description: Manufacturer Link; ComponentLink1URL: http://www.apem.com
U1-9 = SN74HC02N: Quadruple 2-Input Positive-NOR Gate; Published: 8-Jun-2000; LatestRevisionDate: 04-Mar-2005; LatestRevisionNote: Stylized 3D Model Added.; DatasheetVersion: May-1997; PackageVersion: Oct-1995; PackageReference: N014; Publisher: Altium Limited; PackageDescription: DIP; 14 Leads; Row Spacing 7.62 mm; Pitch 2.54 mm; ComponentLink1Description: Manufacturer Link; ComponentLink1URL: http://www.ti.com/; ComponentLink2Description: Datasheet; ComponentLink2URL: http://www-s.ti.com/sc/ds/sn74hc02.pdf